# EAGLE design Lepadatu_Octavian-Stefan_Proiect2026 (EAGLE 9.7.0)
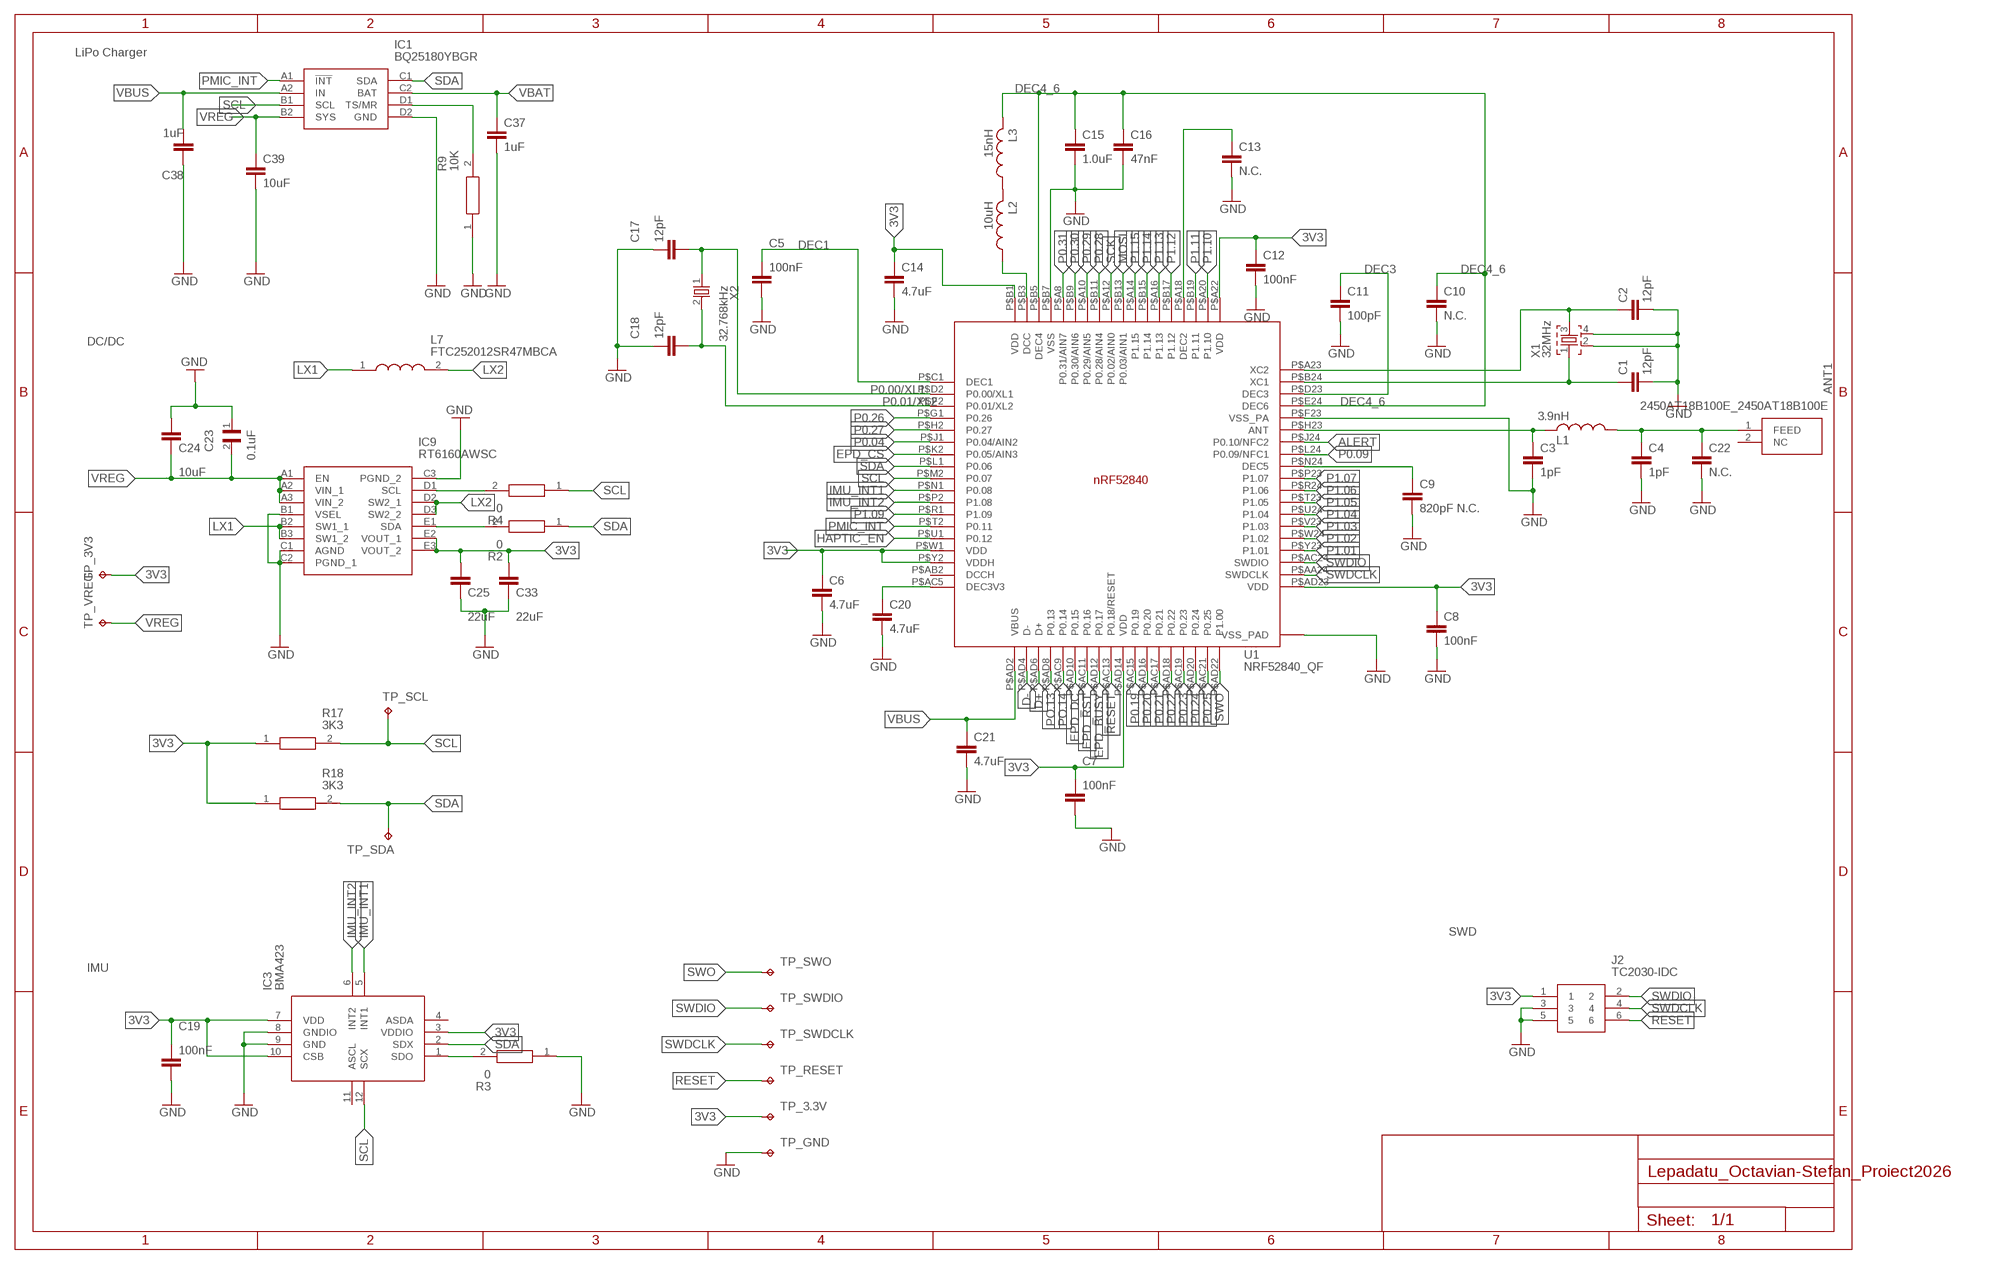
[diagram p0: schematic, sheet 1, part 1 of 2]
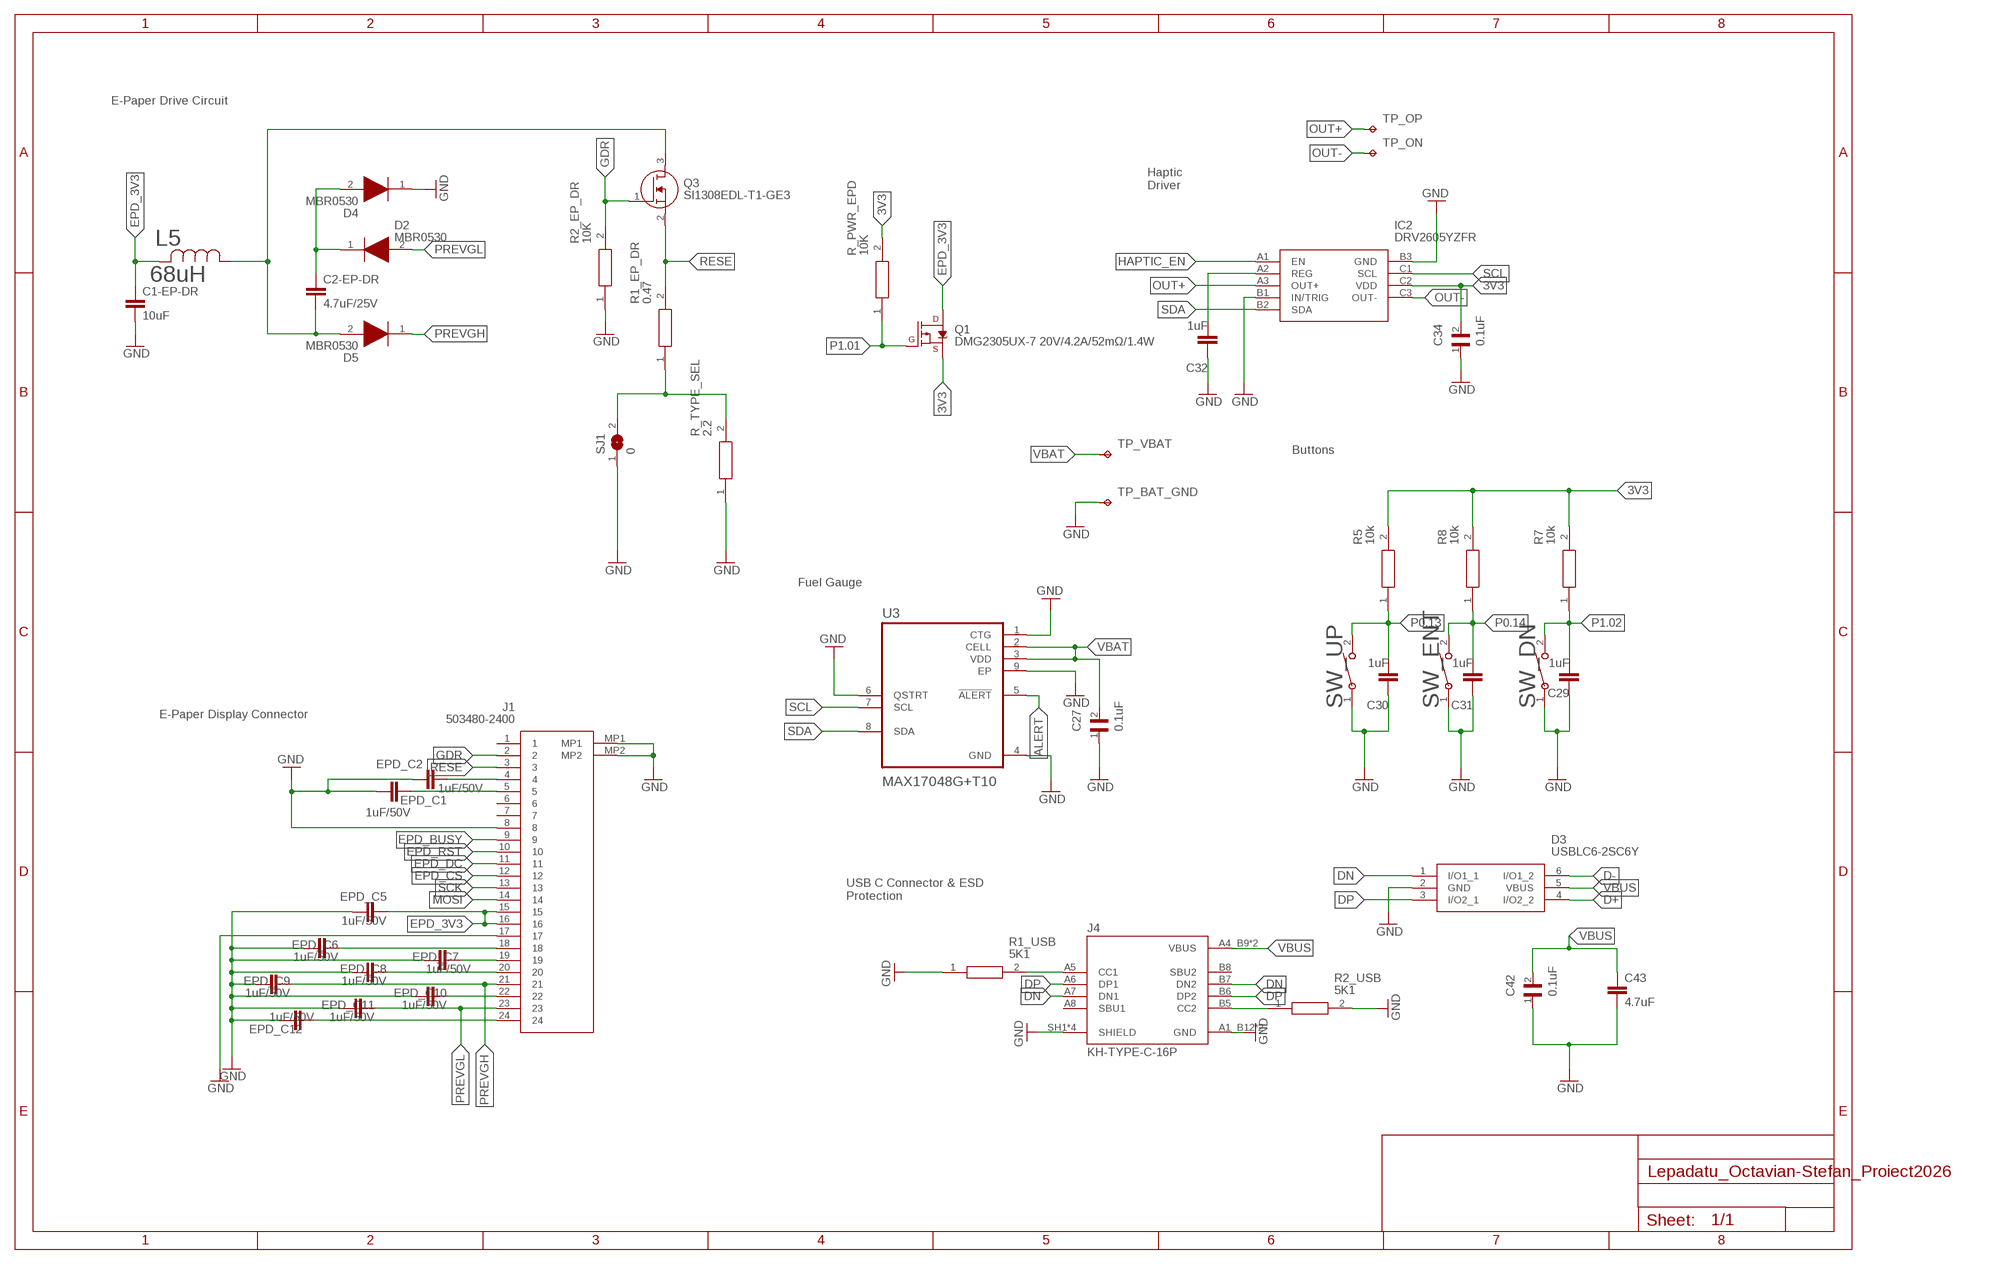
[diagram p1: schematic, sheet 1, part 2 of 2]

## Parts
ANT1  2450AT18B100E_2450AT18B100E  [2450AT18B100E_ANTC3216X140N]
C1  12pF  NORDIC_NRF_3_CAPACITOR_0201_L  [NORDIC_NRF_3_RESC0201_L]
C1-EP-DR  10uF  PERFECT_0402_CAP_0402  [PERFECT_0402_0402]
C2  12pF  NORDIC_NRF_3_CAPACITOR_0201_L  [NORDIC_NRF_3_RESC0201_L]
C2-EP-DR  4.7uF/25V  PERFECT_0402_CAP_0402  [PERFECT_0402_0402]
C3  1pF  NORDIC_NRF_3_CAPACITOR_0201_L  [NORDIC_NRF_3_RESC0201_L]
C4  1pF  NORDIC_NRF_3_CAPACITOR_0201_L  [NORDIC_NRF_3_RESC0201_L]
C5  100nF  NORDIC_NRF_3_CAPACITOR_0201_L  [NORDIC_NRF_3_RESC0201_L]
C6  4.7uF  PERFECT_0402_CAP_0402  [PERFECT_0402_0402]
C7  100nF  NORDIC_NRF_3_CAPACITOR_0201_L  [NORDIC_NRF_3_RESC0201_L]
C8  100nF  NORDIC_NRF_3_CAPACITOR_0201_L  [NORDIC_NRF_3_RESC0201_L]
C9  820pF N.C.  NORDIC_NRF_3_CAPACITOR_0201_L  [NORDIC_NRF_3_RESC0201_L]
C10  N.C.  NORDIC_NRF_3_CAPACITOR_0201_L  [NORDIC_NRF_3_RESC0201_L]
C11  100pF  NORDIC_NRF_3_CAPACITOR_0201_L  [NORDIC_NRF_3_RESC0201_L]
C12  100nF  NORDIC_NRF_3_CAPACITOR_0201_L  [NORDIC_NRF_3_RESC0201_L]
C13  N.C.  NORDIC_NRF_3_CAPACITOR_0201_L  [NORDIC_NRF_3_RESC0201_L]
C14  4.7uF  PERFECT_0402_CAP_0402  [PERFECT_0402_0402]
C15  1.0uF  PERFECT_0402_CAP_0402  [PERFECT_0402_0402]
C16  47nF  NORDIC_NRF_3_CAPACITOR_0201_L  [NORDIC_NRF_3_RESC0201_L]
C17  12pF  NORDIC_NRF_3_CAPACITOR_0201_L  [NORDIC_NRF_3_RESC0201_L]
C18  12pF  NORDIC_NRF_3_CAPACITOR_0201_L  [NORDIC_NRF_3_RESC0201_L]
C19  100nF  NORDIC_NRF_3_CAPACITOR_0201_L  [NORDIC_NRF_3_RESC0201_L]
C20  4.7uF  PERFECT_0402_CAP_0402  [PERFECT_0402_0402]
C21  4.7uF  PERFECT_0402_CAP_0402  [PERFECT_0402_0402]
C22  N.C.  NORDIC_NRF_3_CAPACITOR_0201_L  [NORDIC_NRF_3_RESC0201_L]
C23  0.1uF  GRM011R60J152KE01L_1_GRM011R60J152KE01L  [GRM011R60J152KE01L_1_0201]
C24  10uF  PERFECT_0402_CAP_0402  [PERFECT_0402_0402]
C25  22uF  PERFECT_0402_CAP_0402  [PERFECT_0402_0402]
C27  0.1uF  GRM011R60J152KE01L_2_GRM011R60J152KE01L  [GRM011R60J152KE01L_2_CAPC0201X13N]
C29  1uF  NORDIC_NRF_3_CAPACITOR_0402_L  [NORDIC_NRF_3_RESC0402_L]
C30  1uF  NORDIC_NRF_3_CAPACITOR_0402_L  [NORDIC_NRF_3_RESC0402_L]
C31  1uF  NORDIC_NRF_3_CAPACITOR_0402_L  [NORDIC_NRF_3_RESC0402_L]
C32  1uF  NORDIC_NRF_3_CAPACITOR_0402_L  [NORDIC_NRF_3_RESC0402_L]
C33  22uF  PERFECT_0402_CAP_0402  [PERFECT_0402_0402]
C34  0.1uF  GRM011R60J152KE01L_2_GRM011R60J152KE01L  [GRM011R60J152KE01L_2_CAPC0201X13N]
C37  1uF  NORDIC_NRF_3_CAPACITOR_0402_L  [NORDIC_NRF_3_RESC0402_L]
C38  1uF  NORDIC_NRF_3_CAPACITOR_0402_L  [NORDIC_NRF_3_RESC0402_L]
C39  10uF  NORDIC_NRF_3_CAPACITOR_0402_L  [NORDIC_NRF_3_RESC0402_L]
C42  0.1uF  GRM011R60J152KE01L_2_GRM011R60J152KE01L  [GRM011R60J152KE01L_2_CAPC0201X13N]
C43  4.7uF  PERFECT_0402_CAP_0402  [PERFECT_0402_0402]
D2  MBR0530  ESP32_C6_LIBRARY_5_MBR0530  [ESP32_C6_LIBRARY_5_SOD3716X135N]
D3  USBLC6-2SC6Y  ESP32_C6_LIBRARY_3_USBLC6-2SC6Y  [ESP32_C6_LIBRARY_3_SOT95P280X145-6N]
D4  MBR0530  ESP32_C6_LIBRARY_5_MBR0530  [ESP32_C6_LIBRARY_5_SOD3716X135N]
D5  MBR0530  ESP32_C6_LIBRARY_5_MBR0530  [ESP32_C6_LIBRARY_5_SOD3716X135N]
EPD_C1  1uF/50V  PERFECT_0402_CAP_0402  [PERFECT_0402_0402]
EPD_C2  1uF/50V  PERFECT_0402_CAP_0402  [PERFECT_0402_0402]
EPD_C5  1uF/50V  PERFECT_0402_CAP_0402  [PERFECT_0402_0402]
EPD_C6  1uF/50V  PERFECT_0402_CAP_0402  [PERFECT_0402_0402]
EPD_C7  1uF/50V  PERFECT_0402_CAP_0402  [PERFECT_0402_0402]
EPD_C8  1uF/50V  PERFECT_0402_CAP_0402  [PERFECT_0402_0402]
EPD_C9  1uF/50V  PERFECT_0402_CAP_0402  [PERFECT_0402_0402]
EPD_C10  1uF/50V  PERFECT_0402_CAP_0402  [PERFECT_0402_0402]
EPD_C11  1uF/50V  PERFECT_0402_CAP_0402  [PERFECT_0402_0402]
EPD_C12  1uF/50V  PERFECT_0402_CAP_0402  [PERFECT_0402_0402]
IC1  BQ25180YBGR  BQ25180YBGR_BQ25180YBGR  [BQ25180YBGR_BGA8C40P2X4_100X155X50]
IC2  DRV2605YZFR  DRV2605YZFR_DRV2605YZFR  [DRV2605YZFR_BGA9C50P3X3_144X144X62]
IC3  BMA423  BMA423_BMA423  [BMA423_BMA423]
IC9  RT6160AWSC  RT6160AWSC_RT6160AWSC  [RT6160AWSC_BGA15C40P3X5_140X230X60]
J1  503480-2400  503480-2400_503480-2400  [503480-2400_5034802400]
J2  TC2030-IDC  TC2030-IDC_TC2030-IDC  [TC2030-IDC_TC2030IDC]
J4  KH-TYPE-C-16P  KH-TYPE-C-16P_KH-TYPE-C-16P  [KH-TYPE-C-16P_KINGHELM_KH-TYPE-C-16P]
L1  3.9nH  NORDIC_NRF_2_INDUCTOR_0402_L  [NORDIC_NRF_2_RESC0402_L]
L2  10uH  NORDIC_NRF_2_INDUCTOR_0402_L  [NORDIC_NRF_2_RESC0402_L]
L3  15nH  NORDIC_NRF_2_INDUCTOR_0402_L  [NORDIC_NRF_2_RESC0402_L]
L5  68uH  ESP32_C6_LIBRARY_2_744043680IND_4828-WE-TPC_WRE  [ESP32_C6_LIBRARY_2_IND_4828-WE-TPC_WRE]
L7  FTC252012SR47MBCA  MLP2016SR47MT0S1_FTC252012SR47MBCA  [MLP2016SR47MT0S1_INDC2016X100N]
Q1  DMG2305UX-7 20V/4.2A/52mΩ/1.4W  ESP32_C6_LIBRARY_4_ESP32_WROVER_SPARKFUN-DISCRETESEMI_MOSFET_PCH-DMG2305UX-7  [ESP32_C6_LIBRARY_4_ESP32_C6_LIBRARY_4_ESP32_C6_LIBRARY_4_ESP32_C6_LIBRARY_4_ESP32_WROVER_SPARKFUN-DISCRETESEMI_SOT23-3]
Q3  SI1308EDL-T1-GE3  ESP32_C6_LIBRARY_6_SI1308EDL-T1-GE3  [ESP32_C6_LIBRARY_6_SOT65P210X110-3N]
R1_EP_DR  0.47  ERA-1AEB3401C_CPF0201D7K68C1  [ERA-1AEB3401C_0201]
R1_USB  5K1  CPF0201D7K68C1_CPF0201D7K68C1  [CPF0201D7K68C1_0201]
R2  0  ERA-1AEB3401C_CPF0201D7K68C1  [ERA-1AEB3401C_0201]
R2_EP_DR  10K  ERA-1AEB3401C_CPF0201D7K68C1  [ERA-1AEB3401C_0201]
R2_USB  5K1  CPF0201D7K68C1_CPF0201D7K68C1  [CPF0201D7K68C1_0201]
R3  0  CPF0201D7K68C1_CPF0201D7K68C1  [CPF0201D7K68C1_0201]
R4  0  ERA-1AEB3401C_CPF0201D7K68C1  [ERA-1AEB3401C_0201]
R5  10k  CPF0201D7K68C1_CPF0201D7K68C1  [CPF0201D7K68C1_0201]
R7  10k  CPF0201D7K68C1_CPF0201D7K68C1  [CPF0201D7K68C1_0201]
R8  10k  CPF0201D7K68C1_CPF0201D7K68C1  [CPF0201D7K68C1_0201]
R9  10K  ERA-1AEB3401C_CPF0201D7K68C1  [ERA-1AEB3401C_0201]
R17  3K3  ERA-1AEB3401C_CPF0201D7K68C1  [ERA-1AEB3401C_0201]
R18  3K3  ERA-1AEB3401C_CPF0201D7K68C1  [ERA-1AEB3401C_0201]
R_PWR_EPD  10K  CPF0201D7K68C1_CPF0201D7K68C1  [CPF0201D7K68C1_0201]
R_TYPE_SEL  2.2  ERA-1AEB3401C_CPF0201D7K68C1  [ERA-1AEB3401C_0201]
SJ1  0  ESP32_C6_LIBRARY_7_JUMPER_SJ  [ESP32_C6_LIBRARY_7_JUMPER_SJ]
SW_DN  2025-10-22_07-23-44_LIBRARY_EVP-AKE31ASW_EVP-AKE31A_PAN  [2025-10-22_07-23-44_LIBRARY_SW_EVP-AKE31A_PAN]
SW_ENT  2025-10-22_07-23-44_LIBRARY_EVP-AKE31ASW_EVP-AKE31A_PAN  [2025-10-22_07-23-44_LIBRARY_SW_EVP-AKE31A_PAN]
SW_UP  2025-10-22_07-23-44_LIBRARY_EVP-AKE31ASW_EVP-AKE31A_PAN  [2025-10-22_07-23-44_LIBRARY_SW_EVP-AKE31A_PAN]
TP_3.3V  HECTOR_WATCH_1_TPTP20R  [HECTOR_WATCH_1_TP20R]
TP_3V3  HECTOR_WATCH_1_TPTP20R  [HECTOR_WATCH_1_TP20R]
TP_BAT_GND  HECTOR_WATCH_1_TPTP20R  [HECTOR_WATCH_1_TP20R]
TP_GND  HECTOR_WATCH_1_TPTP20R  [HECTOR_WATCH_1_TP20R]
TP_ON  HECTOR_WATCH_1_TPTP20R  [HECTOR_WATCH_1_TP20R]
TP_OP  HECTOR_WATCH_1_TPTP20R  [HECTOR_WATCH_1_TP20R]
TP_RESET  HECTOR_WATCH_1_TPTP20R  [HECTOR_WATCH_1_TP20R]
TP_SCL  HECTOR_WATCH_1_TPTP20R  [HECTOR_WATCH_1_TP20R]
TP_SDA  HECTOR_WATCH_1_TPTP20R  [HECTOR_WATCH_1_TP20R]
TP_SWDCLK  HECTOR_WATCH_1_TPTP20R  [HECTOR_WATCH_1_TP20R]
TP_SWDIO  HECTOR_WATCH_1_TPTP20R  [HECTOR_WATCH_1_TP20R]
TP_SWO  HECTOR_WATCH_1_TPTP20R  [HECTOR_WATCH_1_TP20R]
TP_VBAT  HECTOR_WATCH_1_TPTP20R  [HECTOR_WATCH_1_TP20R]
TP_VREG  HECTOR_WATCH_1_TPTP20R  [HECTOR_WATCH_1_TP20R]
U1  NRF52840_QF  NORDIC_NRF_4_NRF52840_QF  [NORDIC_NRF_4_AQFN50P700X700X85_HS-74N]
U3  MAX17048G+T10  ESP32_C6_LIBRARY_MAX17048G+T10  [ESP32_C6_LIBRARY_SON50P200X200X80-9N]
X1  32MHz  NORDIC_NRF_XTAL_32MHZ  [NORDIC_NRF_BT-XTAL_2016_N]
X2  32.768kHz  NORDIC_NRF_1_XTAL_32KHZ  [NORDIC_NRF_1_XTAL_3215_N]

## Nets
3V3 [Power]: C6.1 C7.1 C8.1 C12.1 C14.1 C19.1 C25.1 C33.1 C34.2 IC2.C2(VDD) IC3.3(VDDIO) IC3.7(VDD) IC3.10(CSB) IC9.E2(VOUT_1) IC9.E3(VOUT_2) J2.1 Q1.2(S) R5.2 R7.2 R8.2 R17.1 R18.1 R_PWR_EPD.2 TP_3.3V.TP TP_3V3.TP U1.P$A22(VDD) U1.P$AD14(VDD) U1.P$AD23(VDD) U1.P$B1(VDD) U1.P$W1(VDD) U1.P$Y2(VDDH)
ALERT: U1.P$J24(P0.10/NFC2) U3.5(!ALERT)
D+: D3.4(I/O2_2) U1.P$AD6(D+)
D-: D3.6(I/O1_2) U1.P$AD4(D-)
DEC1: C5.1 U1.P$C1(DEC1)
DEC3: C11.1 U1.P$D23(DEC3)
DEC4_6: C10.1 C15.1 C16.1 L3.2 U1.P$B5(DEC4) U1.P$E24(DEC6)
DN: D3.1(I/O1_1) J4.A7(DN1) J4.B7(DN2)
DP: D3.3(I/O2_1) J4.A6(DP1) J4.B6(DP2)
EPD_3V3 [Power]: C1-EP-DR.1 EPD_C5.2 J1.15 J1.16 L5.2 Q1.3(D)
EPD_BUSY: J1.9 U1.P$AD12(P0.17)
EPD_CS: J1.12 U1.P$K2(P0.05/AIN3)
EPD_DC: J1.11 U1.P$AD10(P0.15)
EPD_RST: J1.10 U1.P$AC11(P0.16)
GDR: J1.2 Q3.1(G) R2_EP_DR.2
GND: C1-EP-DR.2 C1.2 C2.2 C3.2 C4.2 C5.2 C6.2 C7.2 C8.2 C9.2 C10.2 C11.2 C12.2 C13.2 C14.2 C15.2 C16.2 C17.1 C18.1 C19.2 C20.2 C21.2 C22.2 C23.1 C24.1 C25.2 C27.1 C29.1 C30.1 C31.1 C32.1 C33.2 C34.1 C37.2 C38.1 C39.2 C42.1 C43.2 D3.2(GND) D4.1(K) EPD_C1.1 EPD_C2.1 EPD_C5.1 EPD_C6.1 EPD_C7.1 EPD_C8.1 EPD_C9.1 EPD_C10.1 EPD_C11.1 EPD_C12.1 IC1.D2(GND) IC2.B1(IN/TRIG) IC2.B3(GND) IC3.8(GNDIO) IC3.9(GND) IC9.B1(VSEL) IC9.C1(AGND) IC9.C2(PGND_1) IC9.C3(PGND_2) J1.8 J1.17 J1.MP1 J1.MP2 J2.3 J2.5 J4.A1_B12(GND) J4.A12_B1(GND) J4.SH1(SHIELD) J4.SH2(SHIELD) J4.SH3(SHIELD) J4.SH4(SHIELD) R1_USB.1 R2_EP_DR.1 R2_USB.2 R3.1 R9.1 R_TYPE_SEL.1 SJ1.1 SW_DN.1 SW_ENT.1 SW_UP.1 TP_BAT_GND.TP TP_GND.TP U1.P$74(VSS_PAD) U1.P$75(VSS_PAD) U1.P$76(VSS_PAD) U1.P$77(VSS_PAD) U1.P$78(VSS_PAD) U1.P$79(VSS_PAD) U1.P$80(VSS_PAD) U1.P$81(VSS_PAD) U1.P$82(VSS_PAD) U1.P$83(VSS_PAD) U1.P$84(VSS_PAD) U1.P$85(VSS_PAD) U1.P$86(VSS_PAD) U1.P$87(VSS_PAD) U1.P$88(VSS_PAD) U1.P$89(VSS_PAD) U1.P$90(VSS_PAD) U1.P$B7(VSS) U1.P$F23(VSS_PA) U3.1(CTG) U3.4(GND) U3.6(QSTRT) U3.9(EP) X1.2 X1.4
HAPTIC_EN: IC2.A1(EN) U1.P$U1(P0.12)
IMU_INT1: IC3.5(INT1) U1.P$N1(P0.08)
IMU_INT2: IC3.6(INT2) U1.P$P2(P1.08)
LX1: IC9.B2(SW1_1) IC9.B3(SW1_2) L7.1
LX2: IC9.D2(SW2_1) IC9.D3(SW2_2) L7.2
MOSI: J1.14 U1.P$B13(P0.03/AIN1)
N$1: ANT1.1(FEED) C4.1 C22.1 L1.2
N$2: IC9.D1(SCL) R4.2
N$3: IC1.D1(TS/MR) R9.2
N$4: C2.1 U1.P$A23(XC2) X1.3
N$5: IC9.E1(SDA) R2.2
N$6: J4.A5(CC1) R1_USB.2
N$7: L2.2 L3.1
N$8: IC3.1(SDO) R3.2
N$9: C1.1 U1.P$B24(XC1) X1.1
N$10: C3.1 L1.1 U1.P$H23(ANT)
N$11: C32.2 IC2.A2(REG)
N$13: C2-EP-DR.1 D2.1(K) D4.2(A)
N$14: C9.1 U1.P$N24(DEC5)
N$15: R1_EP_DR.1 R_TYPE_SEL.2 SJ1.2
N$16: C2-EP-DR.2 D5.2(A) L5.1 Q3.3(D)
N$17: EPD_C2.2 J1.4
N$18: EPD_C1.2 J1.5
N$20: C20.1 U1.P$AC5(DEC3V3)
N$22: L2.1 U1.P$B3(DCC)
N$26: J4.B5(CC2) R2_USB.1
N$30: EPD_C6.2 J1.18
N$31: EPD_C7.2 J1.19
N$32: EPD_C8.2 J1.20
N$34: EPD_C10.2 J1.22
N$35: C13.1 U1.P$A18(DEC2)
N$37: EPD_C12.2 J1.24
OUT+: IC2.A3(OUT+) TP_OP.TP
OUT-: IC2.C3(OUT-) TP_ON.TP
P0.00/XL1: C17.2 U1.P$D2(P0.00/XL1) X2.1
P0.01/XL2: C18.2 U1.P$F2(P0.01/XL2) X2.2
P0.04: U1.P$J1(P0.04/AIN2)
P0.09: U1.P$L24(P0.09/NFC1)
P0.13: C30.2 R5.1 SW_UP.2
P0.14: C31.2 R8.1 SW_ENT.2
P0.19: U1.P$AC15(P0.19)
P0.20: U1.P$AD16(P0.20)
P0.21: U1.P$AC17(P0.21)
P0.22: U1.P$AD18(P0.22)
P0.23: U1.P$AC19(P0.23)
P0.24: U1.P$AD20(P0.24)
P0.25: U1.P$AC21(P0.25)
P0.26: U1.P$G1(P0.26)
P0.27: U1.P$H2(P0.27)
P0.28: U1.P$B11(P0.28/AIN4)
P0.29: U1.P$A10(P0.29/AIN5)
P0.30: U1.P$B9(P0.30/AIN6)
P0.31: U1.P$A8(P0.31/AIN7)
P1.01: Q1.1(G) R_PWR_EPD.1 U1.P$Y23(P1.01)
P1.02: C29.2 R7.1 SW_DN.2 U1.P$W24(P1.02)
P1.03: U1.P$V23(P1.03)
P1.04: U1.P$U24(P1.04)
P1.05: U1.P$T23(P1.05)
P1.06: U1.P$R24(P1.06)
P1.07: U1.P$P23(P1.07)
P1.09: U1.P$R1(P1.09)
P1.10: U1.P$A20(P1.10)
P1.11: U1.P$B19(P1.11)
P1.12: U1.P$B17(P1.12)
P1.13: U1.P$A16(P1.13)
P1.14: U1.P$B15(P1.14)
P1.15: U1.P$A14(P1.15)
PMIC_INT: IC1.A1(!INT) U1.P$T2(P0.11)
PO.13: U1.P$AD8(P0.13)
PO.14: U1.P$AC9(P0.14)
PREVGH: D5.1(K) EPD_C9.2 J1.21
PREVGL: D2.2(A) EPD_C11.2 J1.23
RESE: J1.3 Q3.2(S) R1_EP_DR.2
RESET: J2.6 TP_RESET.TP U1.P$AC13(P0.18/RESET)
SCK: J1.13 U1.P$A12(P0.02/AIN0)
SCL: IC1.B1(SCL) IC2.C1(SCL) IC3.12(SCX) R4.1 R17.2 TP_SCL.TP U1.P$M2(P0.07) U3.7(SCL)
SDA: IC1.C1(SDA) IC2.B2(SDA) IC3.2(SDX) R2.1 R18.2 TP_SDA.TP U1.P$L1(P0.06) U3.8(SDA)
SWDCLK: J2.4 TP_SWDCLK.TP U1.P$AA24(SWDCLK)
SWDIO: J2.2 TP_SWDIO.TP U1.P$AC24(SWDIO)
SWO: TP_SWO.TP U1.P$AD22(P1.00)
VBAT [Power]: C27.2 C37.1 IC1.C2(BAT) TP_VBAT.TP U3.2(CELL) U3.3(VDD)
VBUS [Power]: C21.1 C38.2 C42.2 C43.1 D3.5(VBUS) IC1.A2(IN) J4.A4_B9(VBUS) J4.A9_B4(VBUS) U1.P$AD2(VBUS)
VREG [Power]: C23.2 C24.2 C39.1 IC1.B2(SYS) IC9.A1(EN) IC9.A2(VIN_1) IC9.A3(VIN_2) TP_VREG.TP
Unconnected: ANT1.2(NC) IC3.4(ASDA) IC3.11(ASCL) J1.1 J1.6 J1.7 J4.A8(SBU1) J4.B8(SBU2) U1.P$AB2(DCCH)

## Notes on the sheet
- LiPo Charger
- DC/DC
- SWD
- IMU
- E-Paper Drive Circuit
- Haptic
  Driver
- Buttons
- Fuel Gauge
- E-Paper Display Connector
- USB C Connector & ESD
  Protection

## Library data of the parts
ANT1 = InkTime_v5:2450AT18B100E_2450AT18B100E: Antennas 2.45GHz ANTENNA Source: Datasheet <https://www.johansontechnology.com/datasheets/2450AT18B100/2450AT18B100.pdf>
C1-C5 C7-C13 C16-C19 C22 C29-C32 C37-C39 = InkTime_v5:NORDIC_NRF_3_CAPACITOR: Generic chip capacitor
C1-EP-DR C2-EP-DR C6 C14 C15 C20 C21 C24 C25 C33 C43 EPD_C1 EPD_C2 EPD_C5-EPD_C12 = InkTime_v5:PERFECT_0402_CAP_0402: 0402 (1005 Metric) Nick Garner - TeleSense
C23 = InkTime_v5:GRM011R60J152KE01L_1_GRM011R60J152KE01L: Check availability <https://pricing.snapeda.com/parts/GRM011R60J152KE01L/Murata/view-part?ref=eda>
C27 C34 C42 = InkTime_v5:GRM011R60J152KE01L_2_GRM011R60J152KE01L: Check availability <https://pricing.snapeda.com/parts/GRM011R60J152KE01L/Murata/view-part?ref=eda>
D2 D4 D5 = InkTime_v5:ESP32_C6_LIBRARY_5_MBR0530: ON SEMICONDUCTOR - MBR0530 - DIODE, SCHOTTKY, 0.5A, 30V, SOD-123 Source: Datasheet <http://www.onsemi.com/pub/Collateral/MBR0530T1-D.PDF> Check availability <https://pricing.snapeda.com/parts/MBR0530/ON%20Semiconductor/view-part?ref=eda>
D3 = InkTime_v5:ESP32_C6_LIBRARY_3_USBLC6-2SC6Y: Low Cap. ESD Protection Auto SOT-23-6 STMicroelectronics USBLC6-2SC6Y, Dual Uni-Directional TVS Diode Array, 6-Pin SOT-23 Source: Datasheet <https://componentsearchengine.com/Datasheets/1/USBLC6-2SC6Y.pdf> Check availability <https://pricing.snapeda.com/parts/USBLC6-2SC6Y/STMicroelectronics/view-part?ref=eda>
IC1 = InkTime_v5:BQ25180YBGR_BQ25180YBGR: Charger IC Lithium Ion/Polymer, Lithium Iron Phosphate 8-DSBGA (1.6x1.1) Source: Datasheet <https://www.ti.com/lit/ds/symlink/bq25180.pdf?ts=1650264094470&ref_url=https%3A%2F%2Fwww.ti.com%2Fproduct%2FBQ25180>
IC2 = InkTime_v5:DRV2605YZFR_DRV2605YZFR: Haptic Driver for ERM/LRA with Built-In Library and Smart Loop Architecture Source: Datasheet <http://www.ti.com/lit/gpn/drv2605>
IC3 = InkTime_v5:BMA423_BMA423: Accelerometers Triaxial low-g 12bit Acceleration Sensor Source: Datasheet <https://www.mouser.com/datasheet/2/783/BST-BMA423-DS000-1509600.pdf>
IC9 = InkTime_v5:RT6160AWSC_RT6160AWSC: Buck-Boost Regulator Positive Output Step-Up/Step-Down I2C DC-DC Controller IC 15-WL-CSP (BSC) (1.4x2.3) Source: Datasheet <https://www.richtek.com/SaveDownload.aspx?specid=RT6160A>
J1 = InkTime_v5:503480-2400_503480-2400: FFC & FPC Connectors 0.5mm FPC RA SMT Dual Contact 24Ckt Source: Datasheet <https://componentsearchengine.com/Datasheets/1/503480-2400.pdf>
J2 = InkTime_v5:TC2030-IDC_TC2030-IDC: CABLE ADAPTER 6 POS Source: Datasheet <https://datasheet.datasheetarchive.com/originals/distributors/Datasheets_SAMA/62bc384e093448baaaa63dbd0b9d8707.pdf>
J4 = InkTime_v5:KH-TYPE-C-16P_KH-TYPE-C-16P: Check availability <https://pricing.snapeda.com/parts/KH-TYPE-C-16P/kinghelm/view-part?ref=eda>
L1-L3 = InkTime_v5:NORDIC_NRF_2_INDUCTOR: Generic chip inductor
L5 = InkTime_v5:ESP32_C6_LIBRARY_2_744043680
L7 = InkTime_v5:MLP2016SR47MT0S1_FTC252012SR47MBCA: SMD / SMT Inductors (Coils), L=0.47?H, L x W x T : Source: Datasheet <https://product.tdk.com/system/files/dam/doc/product/inductor/inductor/smd/catalog/inductor_commercial_power_mlp2016_en.pdf>
Q1 = InkTime_v5:ESP32_C6_LIBRARY_4_ESP32_WROVER_SPARKFUN-DISCRETESEMI_MOSFET_PCH: P-channel MOSFETs Voltage controlled devices that allow control of high current outputs. SparkFun Products: SparkFun ESP32 Thing <https://www.sparkfun.com/products/13907> SparkFun ESP8266 Thing <https://www.sparkfun.com/products/13231> SparkFun Pi Servo HAT V2 <https://www.sparkfun.com/products/15316> DMG2305UX-7 (20V/4.2A/SOT23-3)
Q3 = InkTime_v5:ESP32_C6_LIBRARY_6_SI1308EDL-T1-GE3: MOSFET N-Ch 30V 1.5A TrenchFET SC70 Vishay Si1308EDL-T1-GE3 N-channel MOSFET Transistor, 1.5 A, 30 V, 3-Pin SC-70 Source: Datasheet <https://componentsearchengine.com/Datasheets/1/SI1308EDL-T1-GE3.pdf> Check availability <https://pricing.snapeda.com/parts/SI1308EDL-T1-GE3/Vishay%20Siliconix/view-part?ref=eda>
R1_EP_DR R2 R2_EP_DR R4 R9 R17 R18 R_TYPE_SEL = InkTime_v5:ERA-1AEB3401C_CPF0201D7K68C1: 7.68k 0201 Thin Film Surface Mount Fixed Resistor +/-0.5% 0.031W CPF0201D7K68C1 Source: Datasheet <http://www.te.com/commerce/DocumentDelivery/DDEController?Action=showdoc&DocId=Data Sheet1773200-1ApdfEnglishENG_DS_1773200-1_A.pdf4-2176215-6>
R1_USB R2_USB R3 R5 R7 R8 R_PWR_EPD = InkTime_v5:CPF0201D7K68C1_CPF0201D7K68C1: 7.68k 0201 Thin Film Surface Mount Fixed Resistor +/-0.5% 0.031W CPF0201D7K68C1 Source: Datasheet <http://www.te.com/commerce/DocumentDelivery/DDEController?Action=showdoc&DocId=Data Sheet1773200-1ApdfEnglishENG_DS_1773200-1_A.pdf4-2176215-6>
SJ1 = InkTime_v5:ESP32_C6_LIBRARY_7_JUMPER_SJ: SMD solder JUMPER
SW_DN SW_ENT SW_UP = InkTime_v5:2025-10-22_07-23-44_LIBRARY_EVP-AKE31A
TP_3.3V TP_3V3 TP_BAT_GND TP_GND TP_ON TP_OP TP_RESET TP_SCL TP_SDA TP_SWDCLK TP_SWDIO TP_SWO TP_VBAT TP_VREG = InkTime_v5:HECTOR_WATCH_1_TP: Test pad
U1 = InkTime_v5:NORDIC_NRF_4_NRF52840_QF: nRF52840 Features Advanced Single chip 2.4 GHz multi-protocol SoC 32-bit ARM Cortex-M4F Processor 1.7v to 5.5v operation 1MB flash + 256kB RAM Bluetooth 5 support for long range and high throughput 802.15.4 radio support On-chip NFC PPI –Programmable Peripheral Interconnect Automated power management system with automatic power management of each peripheral Configurable I/O mapping for analog and digital I/O 48 x GPIO 1 x QSPI 4 x Master/Slave SPI 2 x Two-wire interface (I²C) I²S interface 2 x UART 4 x PWM USB 2.0 controller ARM TrustZone CryptoCell-310 Cryptographic and security module AES 128-bit ECB/CCM/AAR hardware accelerator Digital microphone interface (PDM) Quadrature decoder 12-bit ADC Low power comparator On-chip 50Ω balun On-air compatible with nRF52, nRF51 and nRF24 Series Applications Advanced high performance wearables Wearables for secure payments Virtual Reality/Augmented Reality systems Smart Home sensor networks Smart city sensor networks High performance HID controllers Internet of Things (IoT) sensor networks Smart door locks Smart lighting networks Connected white goods
U3 = InkTime_v5:ESP32_C6_LIBRARY_MAX17048G+T10: Check availability <https://pricing.snapeda.com/parts/MAX17048G%2BT10/Analog%20Devices/view-part?ref=eda>
X1 = InkTime_v5:NORDIC_NRF_XTAL_32MHZ
X2 = InkTime_v5:NORDIC_NRF_1_XTAL_32KHZ

## Board
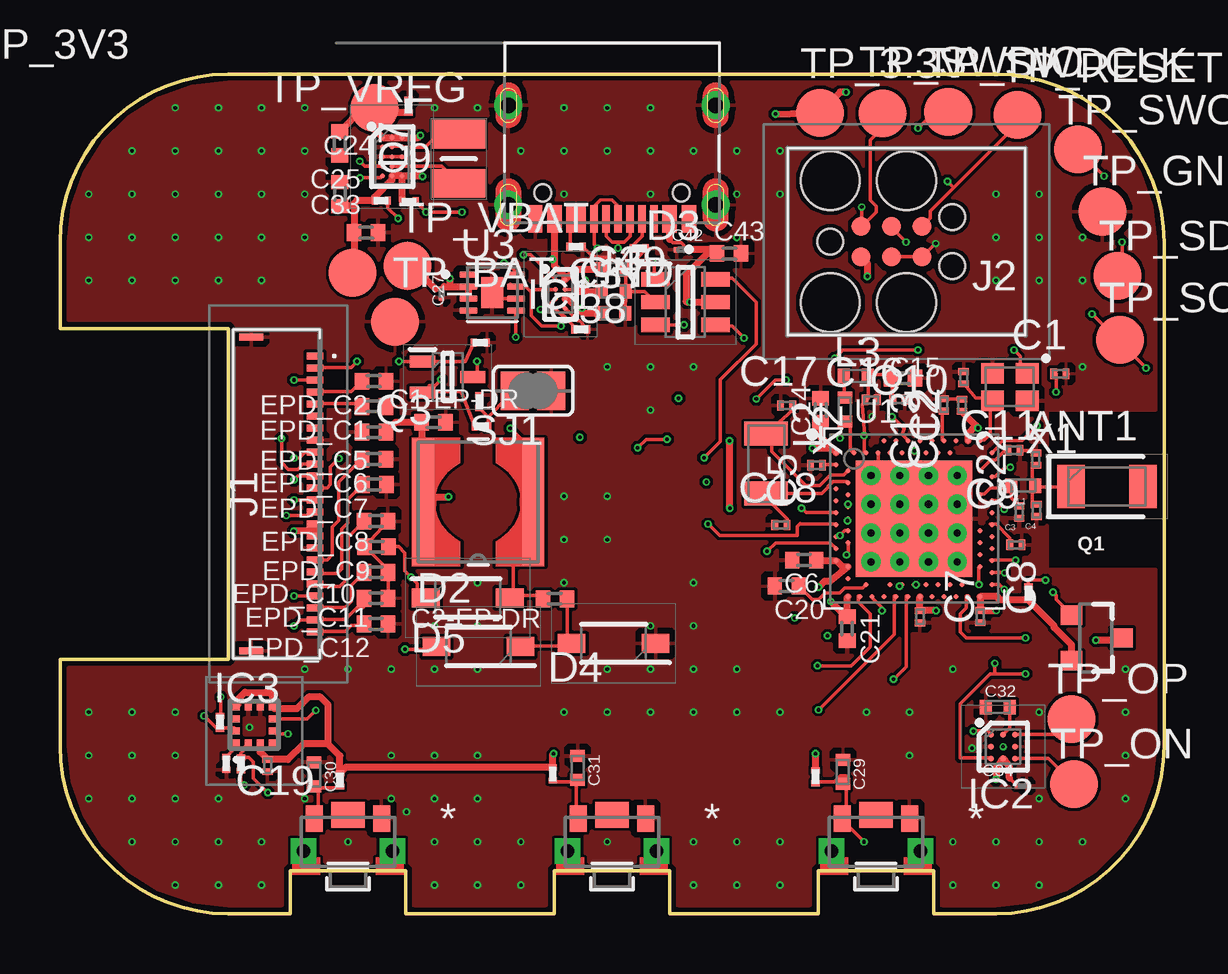
[diagram p2: board, top side]
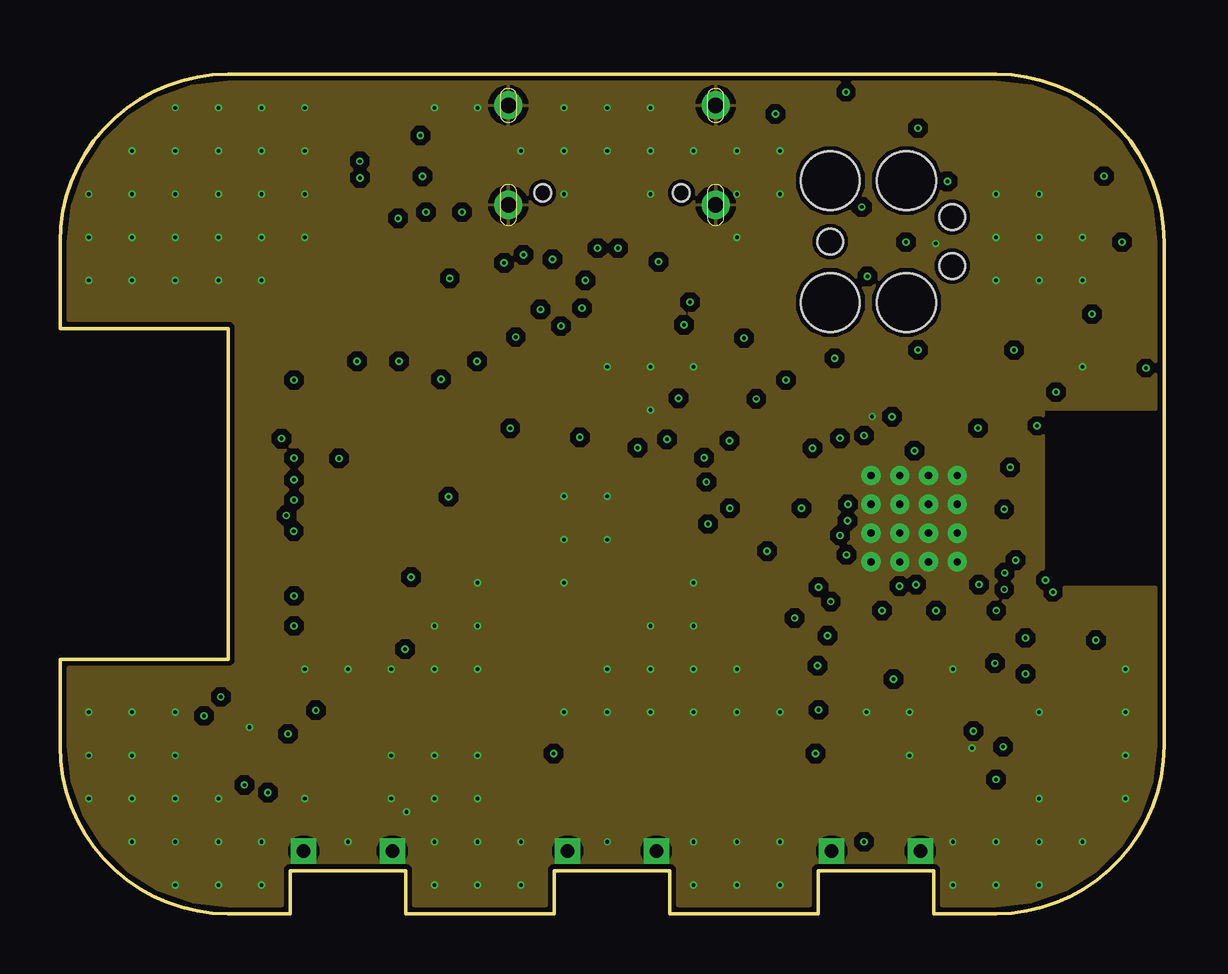
[diagram p3: board, inner layer Route2]
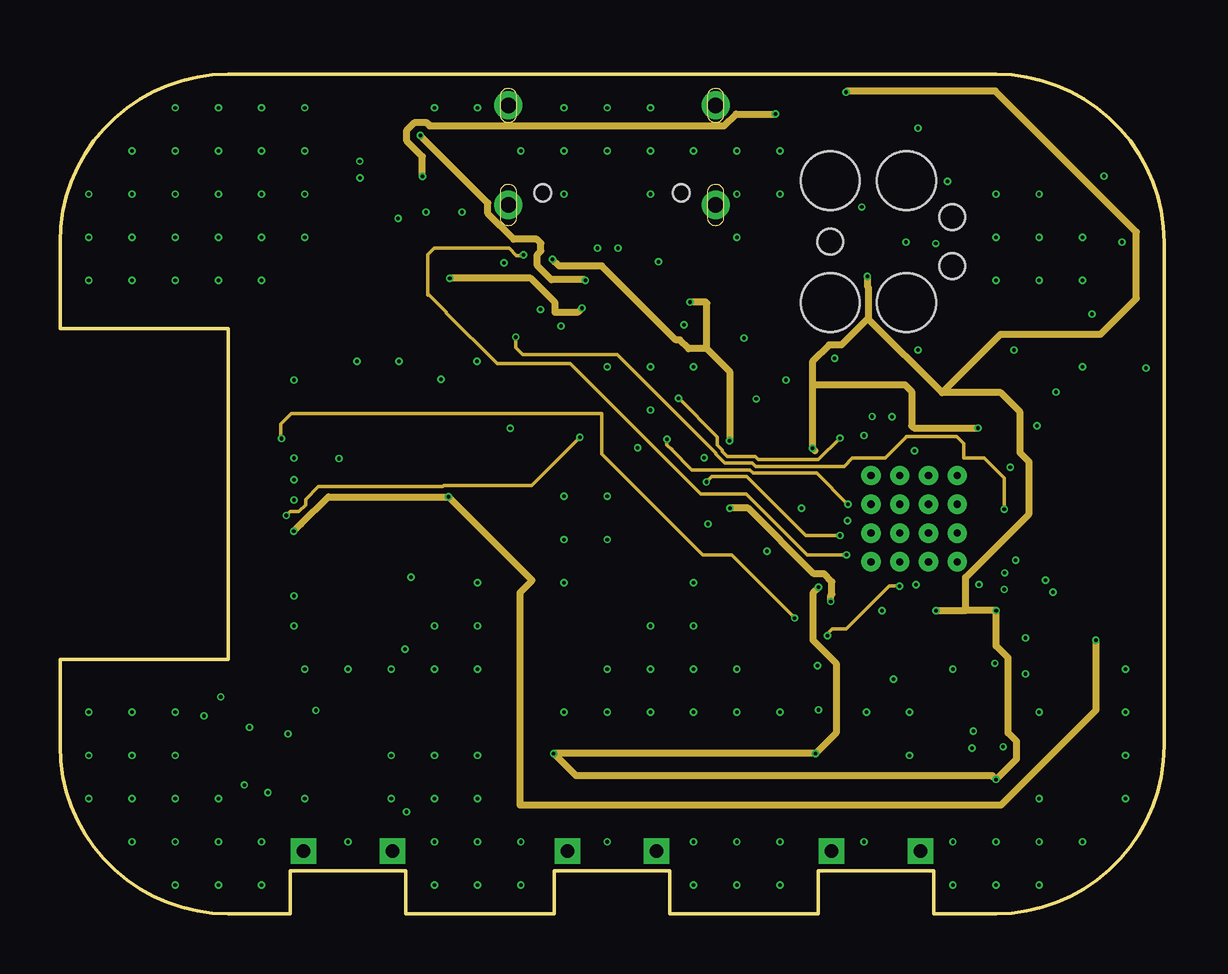
[diagram p4: board, inner layer Route63]
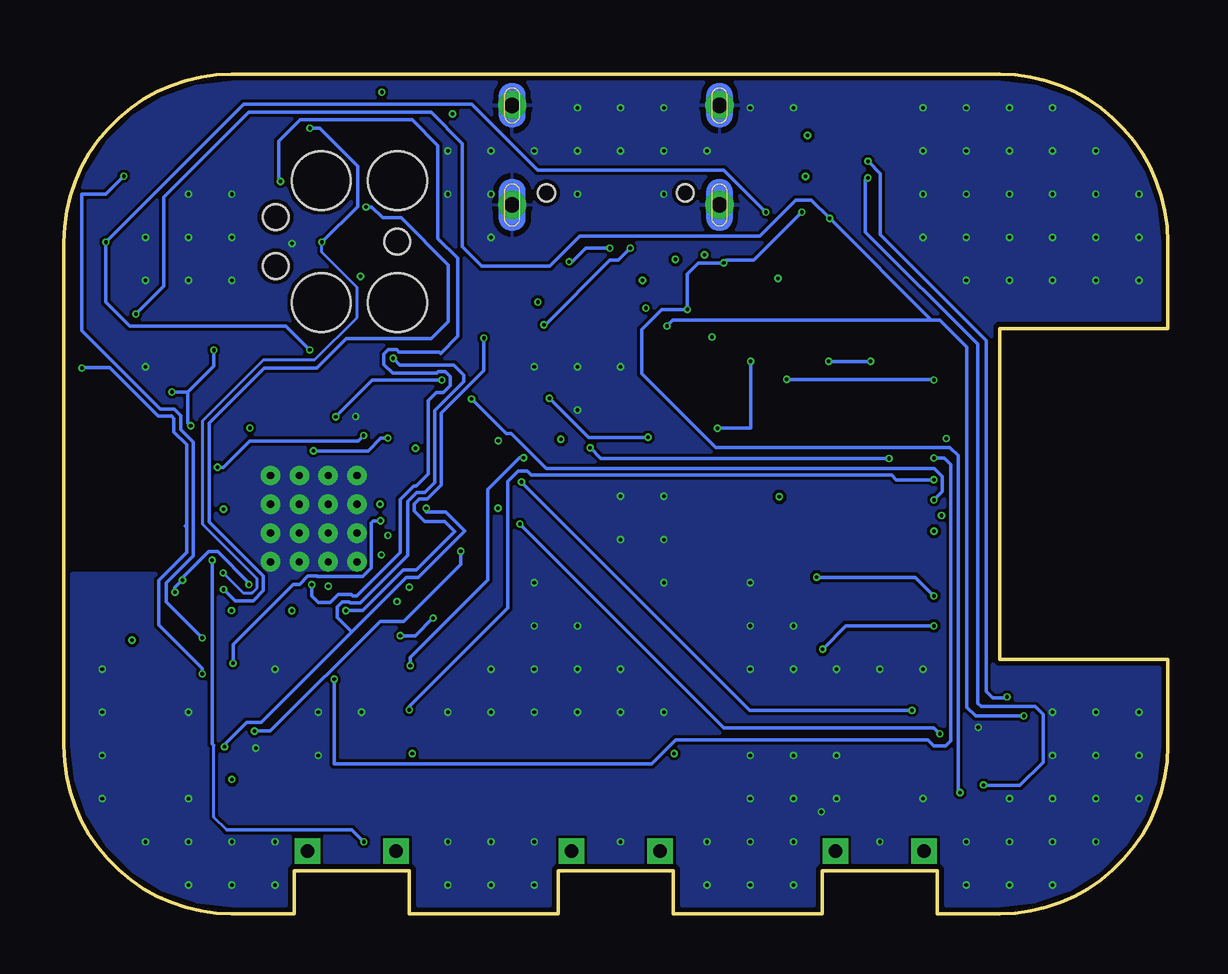
[diagram p5: board, bottom side, seen from below]

Size 46 x 35 mm. Coordinates in mm from the lower left corner, seen from the top.
Outline: 39,0 36.4,0 36.4,1.8 31.6,1.8 31.6,0 25.4,0 25.4,1.8 20.6,1.8 20.6,0 14.4,0 14.4,1.8 9.6,1.8 9.6,0 7,0 arc-90 0,7 0,10.6 7,10.6 7,24.4 0,24.4 0,28 arc-90 7,35 39,35 arc-90 46,28 46,7 arc-90 39,0
Copper layers (1+2*15+16): Top / Route2 / Route63 / Bottom
Stack-up 4 Layer Stack: Top SilkScreen Epoxy Ink / Top SolderMask SR:Green 0.0254mm Dk 4.3 / Top Surface Finish Lead-Free 0.02mm / Top CuFoil:007 0.035mm / Dielectric-1 Prepreg:003 0.061mm / Dielectric-2 Prepreg:003 0.061mm / Route2 CuFoil:007 0.035mm / Dielectric-3 Core:070 0.533mm / Route63 CuFoil:007 0.035mm / Dielectric-4 Prepreg:003 0.061mm / Dielectric-5 Prepreg:003 0.061mm / Bottom CuFoil:007 0.035mm / Bottom Surface Finish Lead-Free 0.02mm / Bottom SolderMask SR:Green 0.0254mm Dk 4.3 / Bottom SilkScreen Epoxy Ink
Design rules: minimum copper width 5mil, minimum drill size 0.15mm, copper clearance wire_polygon to wire_polygon 5mil, copper clearance wire_polygon to pad_smd 5mil, copper clearance wire_polygon to via 5mil, copper clearance pad_smd to pad_smd 5mil, copper clearance pad_smd to via 5mil, copper clearance via to via 5mil, copper clearance smd to pad (same net) 5mil, copper clearance smd to via (same net) 5mil, copper clearance smd to smd (same net) 5mil, dimension clearance 0.2mm, via restrict clearance 0mil, restrict clearance 0mil, drill distance 6mil, keepout clearance 0mil
RestrictTop: area 41.2,14.4 to 50.4,20.9

### Footprints (pad centres in the part's own frame; a part is rotated, then mirrored left to right if it is on the bottom)
2450AT18B100E_ANTC3216X140N = smd 1.15 x 1.8: 1 -1.5,0; 2 1.5,0
NORDIC_NRF_3_RESC0201_L = smd 0.28 x 0.43: 1 -0.255,0; 2 0.255,0
PERFECT_0402_0402 = smd 0.6 x 0.7: 1 -0.5,0; 2 0.5,0
GRM011R60J152KE01L_1_0201 = smd 0.35 x 0.25: 1 0,0.275; 2 0,-0.275
GRM011R60J152KE01L_2_CAPC0201X13N = smd 0.22 x 0.23: 1 -0.185,0; 2 0.185,0
NORDIC_NRF_3_RESC0402_L = smd 0.5 x 0.6: 1 -0.5,0; 2 0.5,0
ESP32_C6_LIBRARY_5_SOD3716X135N = smd 1.15 x 0.8: 1 -1.75,0; 2 1.75,0
ESP32_C6_LIBRARY_3_SOT95P280X145-6N = smd 1.2 x 0.6: 1 -1.25,0.95; 2 -1.25,0; 3 -1.25,-0.95; 4 1.25,-0.95; 5 1.25,0; 6 1.25,0.95
BQ25180YBGR_BGA8C40P2X4_100X155X50 = smd 0.2 x 0.2: A1 -0.2,0.6; A2 0.2,0.6; B1 -0.2,0.2; B2 0.2,0.2; C1 -0.2,-0.2; C2 0.2,-0.2; D1 -0.2,-0.6; D2 0.2,-0.6
DRV2605YZFR_BGA9C50P3X3_144X144X62 = smd 0.25 x 0.25: A1 -0.5,0.5; A2 0,0.5; A3 0.5,0.5; B1 -0.5,0; B2 0,0; B3 0.5,0; C1 -0.5,-0.5; C2 0,-0.5; C3 0.5,-0.5
BMA423_BMA423 = smd 0.3 x 0.35: 1 -0.75,-0.775; 2 -0.25,-0.775; 3 0.25,-0.775; 4 0.75,-0.775; 7 0.75,0.775; 8 0.25,0.775; 9 -0.25,0.775; 10 -0.75,0.775 | smd 0.35 x 0.3: 5 0.775,-0.25; 6 0.775,0.25; 11 -0.775,0.25; 12 -0.775,-0.25
RT6160AWSC_BGA15C40P3X5_140X230X60 = smd 0.216 x 0.216: A1 -0.4,0.8; A2 0,0.8; A3 0.4,0.8; B1 -0.4,0.4; B2 0,0.4; B3 0.4,0.4; C1 -0.4,0; C2 0,0; C3 0.4,0; D1 -0.4,-0.4; D2 0,-0.4; D3 0.4,-0.4; E1 -0.4,-0.8; E2 0,-0.8; E3 0.4,-0.8
503480-2400_5034802400 = smd 0.3 x 0.7: 1 -5.75,1.525; 2 -5.25,1.525; 3 -4.75,1.525; 4 -4.25,1.525; 5 -3.75,1.525; 6 -3.25,1.525; 7 -2.75,1.525; 8 -2.25,1.525; 9 -1.75,1.525; 10 -1.25,1.525; 11 -0.75,1.525; 12 -0.25,1.525; 13 0.25,1.525; 14 0.75,1.525; 15 1.25,1.525; 16 1.75,1.525; 17 2.25,1.525; 18 2.75,1.525; 19 3.25,1.525; 20 3.75,1.525; 21 4.25,1.525; 22 4.75,1.525; 23 5.25,1.525; 24 5.75,1.525 | smd 0.3 x 1: MP1 -6.54,-1.125; MP2 6.54,-1.125
TC2030-IDC_TC2030IDC = smd 0.783 x 0.783: 1 -0.953,-0.635; 2 -0.953,0.635; 3 0.317,-0.635; 4 0.317,0.635; 5 1.588,-0.635; 6 1.588,0.635 | hole 2.451: -2.223,-2.54; -2.223,2.54; 0.952,-2.54; 0.952,2.54 | hole 1.067: -2.223,0; 2.857,-1.016; 2.857,1.016
KH-TYPE-C-16P_KINGHELM_KH-TYPE-C-16P = smd 0.6 x 1.15: A1_B12 -3.2,4.725; A4_B9 -2.4,4.725; A9_B4 2.4,4.725; A12_B1 3.2,4.725 | smd 0.3 x 1.15: A5 -1.25,4.725; A6 -0.25,4.725; A7 0.25,4.725; A8 1.25,4.725; B5 1.75,4.725; B6 0.75,4.725; B7 -0.75,4.725; B8 -1.75,4.725 | drill 0.65 pad 1.05: SH1 -4.32,0; SH2 4.32,0; SH3 -4.32,4.15; SH4 4.32,4.15 | hole 0.7: -2.89,3.65; 2.89,3.65
NORDIC_NRF_2_RESC0402_L = smd 0.5 x 0.6: 1 -0.5,0; 2 0.5,0
ESP32_C6_LIBRARY_2_IND_4828-WE-TPC_WRE = smd 0.9 x 5.3: 1 -2.286,0; 2 2.286,0
MLP2016SR47MT0S1_INDC2016X100N = smd 1.2 x 2.2: 1 -1.028,0; 2 1.028,0
ESP32_C6_LIBRARY_4_ESP32_C6_LIBRARY_4_ESP32_C6_LIBRARY_4_ESP32_C6_LIBRARY_4_ESP32_WROVER_SPARKFUN-DISCRETESEMI_SOT23-3 = smd 0.8 x 0.9: 1 -0.95,-1; 2 0.95,-1; 3 0,1.1
ESP32_C6_LIBRARY_6_SOT65P210X110-3N = smd 1.05 x 0.5: 1 -1.05,0.65; 2 -1.05,-0.65; 3 1.05,0
ERA-1AEB3401C_0201 = smd 0.35 x 0.25: 1 0,0.275; 2 0,-0.275
CPF0201D7K68C1_0201 = smd 0.35 x 0.25: 1 0,0.275; 2 0,-0.275
ESP32_C6_LIBRARY_7_JUMPER_SJ = smd 1.168 x 1.6: 1 -0.762,0; 2 0.762,0
2025-10-22_07-23-44_LIBRARY_SW_EVP-AKE31A_PAN = smd 0.711 x 1.092: 1 -1.4,-0.972; 2 1.4,-0.972 | drill 0.559 pad 0.914 square: 3 -1.848,0.381; 4 1.848,0.381 | smd 1.397 x 1.092: 5 0,-1.124
HECTOR_WATCH_1_TP20R = smd 2 x 2: TP 0,0
NORDIC_NRF_4_AQFN50P700X700X85_HS-74N = smd 4.85 x 4.85: P$74 0,0 | drill 0.3 pad 0.6: P$75 -1.8,1.8; P$76 -0.6,1.8; P$77 0.6,1.8; P$78 1.8,1.8; P$79 -1.8,0.6; P$80 -0.6,0.6; P$81 0.6,0.6; P$82 1.8,0.6; P$83 -1.8,-0.6; P$84 -0.6,-0.6; P$85 0.6,-0.6; P$86 1.8,-0.6; P$87 -1.8,-1.8; P$88 -0.6,-1.8; P$89 0.6,-1.8; P$90 1.8,-1.8 | smd 0.2 x 0.2: P$A8 -1.25,3.25; P$A10 -0.75,3.25; P$A12 -0.25,3.25; P$A14 0.25,3.25; P$A16 0.75,3.25; P$A18 1.25,3.25; P$A20 1.75,3.25; P$A22 2.25,3.25; P$A23 2.75,3.25; P$AA24 3.25,-2.25; P$AB2 -2.75,-2.5; P$AC5 -2,-2.75; P$AC9 -1,-2.75; P$AC11 -0.5,-2.75; P$AC13 0,-2.75; P$AC15 0.5,-2.75; P$AC17 1,-2.75; P$AC19 1.5,-2.75; P$AC21 2,-2.75; P$AC24 3.25,-2.75; P$AD2 -2.75,-3.25; P$AD4 -2.25,-3.25; P$AD6 -1.75,-3.25; P$AD8 -1.25,-3.25; P$AD10 -0.75,-3.25; P$AD12 -0.25,-3.25; P$AD14 0.25,-3.25; P$AD16 0.75,-3.25; P$AD18 1.25,-3.25; P$AD20 1.75,-3.25; P$AD22 2.25,-3.25; P$AD23 2.75,-3.25; P$B1 -3.25,2.75; P$B3 -2.5,2.75; P$B5 -2,2.75; P$B7 -1.5,2.75; P$B9 -1,2.75; P$B11 -0.5,2.75; P$B13 0,2.75; P$B15 0.5,2.75; P$B17 1,2.75; P$B19 1.5,2.75; P$B24 3.25,2.75; P$C1 -3.25,2.25; P$D2 -2.75,2; P$D23 2.75,2; P$E24 3.25,1.75; P$F2 -2.75,1.5; P$F23 2.75,1.5; P$G1 -3.25,1.25; P$H2 -2.75,1; P$H23 2.75,1; P$J1 -3.25,0.75; P$J24 3.25,0.75; P$K2 -2.75,0.5; P$L1 -3.25,0.25; P$L24 3.25,0.25; P$M2 -2.75,0; P$N1 -3.25,-0.25; P$N24 3.25,-0.25; P$P2 -2.75,-0.5; P$P23 2.75,-0.5; P$R1 -3.25,-0.75; P$R24 3.25,-0.75; P$T2 -2.75,-1; P$T23 2.75,-1; P$U1 -3.25,-1.25; P$U24 3.25,-1.25; P$V23 2.75,-1.5; P$W1 -3.25,-1.75; P$W24 3.25,-1.75; P$Y2 -2.75,-2; P$Y23 2.75,-2
ESP32_C6_LIBRARY_SON50P200X200X80-9N = smd 0.76 x 0.27: 1 -0.985,0.75; 2 -0.985,0.25; 3 -0.985,-0.25; 4 -0.985,-0.75; 5 0.985,-0.75; 6 0.985,-0.25; 7 0.985,0.25; 8 0.985,0.75 | smd 0.9 x 1.3: 9 0,0
NORDIC_NRF_BT-XTAL_2016_N = smd 0.95 x 0.85: 1 -0.725,-0.575; 2 0.725,-0.575; 3 0.725,0.575; 4 -0.725,0.575
NORDIC_NRF_1_XTAL_3215_N = smd 1 x 1.8: 1 -1.25,0; 2 1.25,0

### Placement (x,y rotation side)
ANT1  43.62,17.81 0 top
C1  41.66,22.51 0 top
C1-EP-DR  15.57,20.49 0 top
C2  37.65,22.35 90 top
C2-EP-DR  20.62,13.13 180 top
C3  39.97,16.74 270 top
C4  40.69,16.82 270 top
C5  31.52,18.7 180 top
C6  31.01,14.74 180 top
C7  35.83,12.38 270 top
C8  38.34,12.39 270 top
C9  39.83,15.38 0 top
C10  34.95,21.44 0 top
C11  39.75,19.32 0 top
C12  37.58,21.2 90 top
C13  36.82,21.21 90 top
C14  31.69,20.99 90 top
C15  35.12,22.33 0 top
C16  33.8,21.42 0 top
C17  30.28,21.19 0 top
C18  30.04,16.21 0 top
C19  8.65,6.18 270 top
C20  30.28,13.66 180 top
C21  32.8,11.89 270 top
C22  40.66,18.95 90 top
C23  14.52,33.67 0 top
C24  11.65,32.11 90 top
C25  11.66,30 90 top
C27  15.89,25.86 90 top
C29  32.62,5.92 270 top
C30  10.59,5.82 270 top
C31  21.57,6.08 270 top
C32  39.07,8.62 0 top
C33  12.75,28.4 0 top
C34  40.08,5.33 180 top
C37  23.05,25.02 0 top
C38  23.07,26.87 180 top
C39  23.07,25.94 0 top
C42  25.87,27.67 0 top
C43  27.88,27.53 0 top
D2  17.44,11.14 180 top
D3  26.06,25.5 0 top
D4  23.07,11.27 180 top
D5  16.99,13.17 0 top
EPD_C1  13.08,21.15 180 top
EPD_C2  13.08,22.2 180 top
EPD_C5  13.08,20.08 0 top
EPD_C6  13.08,18.95 180 top
EPD_C7  13.1,17.89 180 top
EPD_C8  13.17,16.37 180 top
EPD_C9  13.19,15.3 0 top
EPD_C10  13.17,14.23 180 top
EPD_C11  13.17,13.15 180 top
EPD_C12  13.17,12.08 180 top
IC1  20.85,25.83 0 top
IC2  39.3,6.97 0 top
IC3  8.09,7.88 0 top
IC9  13.84,31.56 0 top
J1  9.1,17.5 270 top
J2  34.32,28.02 0 top
J4  23,33.7 180 top
L1  40.13,17.85 0 top
L2  32.7,21.03 90 top
L3  33.16,22.43 0 top
L5  17.42,17.16 180 top
L7  16.61,31.47 270 top
Q1  43.15,11.5 270 top
Q3  16.15,22.38 0 top
R1_EP_DR  17.56,20.32 270 top
R1_USB  24.14,27.74 270 top
R2  7.54,6.25 0 top
R2_EP_DR  17.51,23.81 270 top
R2_USB  21.5,27.81 90 top
R3  6.93,6.27 180 top
R4  6.67,7.98 180 top
R5  11.66,5.58 180 top
R7  31.48,5.71 180 top
R8  20.53,5.83 180 top
R9  21.7,24.36 270 top
R17  13.38,29.73 90 top
R18  14.54,29.69 90 top
R_PWR_EPD  40.35,13.36 0 top
R_TYPE_SEL  17.47,21.35 0 top
SJ1  19.71,21.8 180 top
SW_DN  34,3 180 top
SW_ENT  23,3 180 top
SW_UP  12,3 180 top
TP_3.3V  31.67,33.39 0 top
TP_3V3  12.2,26.73 0 top
TP_BAT_GND  13.96,24.68 0 top
TP_GND  43.43,29.27 0 top
TP_ON  42.24,5.41 0 top
TP_OP  42.14,8.12 0 top
TP_RESET  39.9,33.31 0 top
TP_SCL  44.16,23.93 0 top
TP_SDA  44.07,26.59 0 top
TP_SWDCLK  37.01,33.42 0 top
TP_SWDIO  34.28,33.36 0 top
TP_SWO  42.41,31.87 0 top
TP_VBAT  14.48,27.01 0 top
TP_VREG  13.11,33.59 0 top
U1  35.59,16.47 0 top
U3  18.01,25.9 0 top
X1  39.58,21.96 180 top
X2  29.42,18.76 270 top

### Tracks (layer width: path | path; a pad name or v marks a point on that pad's centre or on a via)
3V3  (via drill 0.15 pad 0.3)
  Top 0.15: C34.2 39.56,5.66
  Top 0.3: C14.1 31.69,19.87 32.15,19.41 | C6.1 31.53,14.72 U1.P$W1 32.59,14.47 U1.P$Y2 32.07,13.85 31.85,13.85 v31.61,13.61 | U1.P$AD14 C7.1 v36.5,12.64 | IC3.3 8.34,6.74 C19.1 9.49,6.44 10.15,7.09 11.16,7.09 | IC9.E3 15.08,30.76 v15.1,30.74 | R18.1 14.27,30.73 IC9.E3 | 12.01,26.91 TP_3V3.TP 12.25,26.78 C33.1 12.25,29.62 | J2.1 33.64,27.11 v33.64,26.57 | v20.57,6.68 20.53,6.64 R8.2 11.91,6.11 R5.2 11.66,6.59 11.16,7.09 | R7.2 v31.48,6.68 | IC3.10 7.42,8.73 7.42,8.94 7.7,9.23 8.71,9.23 8.84,9.1 IC3.7 8.94,8.55 9.88,8.55 10.39,9.06 10.82,9.06 11.16,8.72 11.16,7.09 | 39.56,5.66 39.56,6.14 39.4,6.3 39.4,6.37 IC2.C2 39.2,6.37 39.2,6.3 39,6.1 v39,5.6 | v39.01,12.64 v39,12.64 C8.1 U1.P$AD23 39.04,13.22 39.16,13.09 40.34,13.09 R_PWR_EPD.2 41.43,12.01 41.43,11.93 42.15,11.21 Q1.2 | IC9.E3 IC9.E2 13.82,30.74 13.82,30.6 13.11,29.88 R17.1 12.36,29.73 12.25,29.62 | v32.75,34.25 32.5,34.25 31.75,33.5 TP_3.3V.TP v29.81,33.34 | C12.1 38.17,20.36 | 38.17,20.36 38.25,20.27 v38.25,20.25 | U1.P$A22 37.84,20.03 38.17,20.36 | v31.35,19.41 32.15,19.41 | 32.15,19.41 U1.P$B1 | 12.25,29.62 12.13,29.5 C25.1
  Route63 0.3: v29.81,33.34 28.17,33.34 27.68,32.84 15.4,32.84 15.24,33 14.78,33 14.46,32.67 14.46,32.21 15.1,31.57 v15.1,30.74 | 33.67,24.83 33.67,26.13 33.64,26.16 v33.64,26.57 | v31.61,13.61 31.37,13.37 31.37,11.41 32.34,10.44 32.34,7.54 v31.48,6.68 v20.57,6.68 21.5,5.75 38.85,5.75 v39,5.6 39.86,6.46 39.86,7.19 39.5,7.54 39.5,10.67 39.01,11.16 v39.01,12.64 37.73,12.64 | v36.5,12.64 37.73,12.64 | 37.73,12.64 | 37.73,12.64 37.73,14.02 40.38,16.67 40.38,18.84 40,19.21 40,20.91 39.2,21.72 36.75,21.72 | 36.75,21.72 33.67,24.8 33.67,24.83 | 36.75,21.72 39.19,24.16 43.36,24.16 44.85,25.65 44.85,28.42 38.97,34.3 32.8,34.3 v32.75,34.25 | 33.67,24.83 32.56,23.71 32.05,23.71 31.35,23.02 31.35,22.06 | 31.35,22.06 v31.35,19.41 31.47,19.29 | v38.25,20.25 35.58,20.25 35.48,20.35 35.48,21.78 35.2,22.06 31.35,22.06
ALERT  (via drill 0.15 pad 0.3)
  Top 0.15: U1.P$J24 38.98,17.22 v39.34,16.86 | v18.99,24.04 U3.5
  Route63 0.15: v39.34,16.86 39.34,18.16 38.5,19 37.65,19 37.65,19.6 37.36,19.89 35.27,19.89 35.27,19.88 34.38,18.99 33.01,18.99 32.68,18.65 28.98,18.65 28.85,18.78 27.7,18.78 27.32,19.16 27.32,19.21 23.22,23.31 19.28,23.31 18.99,23.6 v18.99,24.04
D+  (via drill 0.15 pad 0.3)
  Top 0.15: v28.5,24 28,24.5 27.5,24.5 D3.4 | v34.25,12.64 34.25,12.75 33.84,13.16 U1.P$AD6
  Bottom 0.15: v34.25,12.64 33.54,12.64 31.85,14.33 31.31,14.33 29.71,15.93 30.13,16.35 30.96,16.35 31.39,16.78 31.39,17.08 31.19,17.28 30.86,17.28 30.27,17.87 30.27,20.87 28.5,22.64 v28.5,24
D-  (via drill 0.15 pad 0.3)
  Top 0.15: U1.P$AD4 33.25,13.25 33.25,13 33.75,12.5 33.75,11.12 32.97,10.34 v31.57,10.34 | D3.6 27.5,26.5 28,26.5 29,25.5 29,23.75 27.52,22.27 27.52,19.69 v26.84,19.01
  Bottom 0.15: v31.57,10.34 31.57,10.68 28.33,13.92 28.33,17.69 27.01,19.01 v26.84,19.01
DEC1
  Top 0.15: C5.1 31.8,18.72 U1.P$C1
DEC3
  Top 0.15: U1.P$D23 38.79,18.92 38.96,18.92 39.36,19.32 C11.1
DEC4_6  (via drill 0.15 pad 0.3)
  Top 0.15: C10.1 34.67,21.47 34.67,22.22 C15.1 34.42,22.47 33.67,22.47 L3.2 33.67,22.22 33.67,21.47 C16.1 33.42,21.22 33.5,20.18 33.5,19.71 33.51,19.71 | 33.5,19.25 U1.P$B5 33.51,19.3 33.51,19.71 | U1.P$E24 38.97,18.22 39.36,18.61 v39.59,18.61 | 33.51,19.71 v33.51,19.94
  Bottom 0.15: v33.51,19.94 33.73,19.71 38.26,19.71 39.36,18.61 v39.59,18.61
DN  (via drill 0.15 pad 0.3)
  Top 0.15: J4.A7 22.75,28.25 23,28 23.25,28 | 23.25,28 23.5,28 23.75,28.25 J4.B7 | 23.25,28 v23.25,27.75 | D3.1 24.75,26.5 24.75,26.99 v24.94,27.18
  Bottom 0.15: v23.25,27.75 24.25,27.75 24.82,27.18 v24.94,27.18
DP  (via drill 0.15 pad 0.3)
  Top 0.127: 23,29.75 22.5,29.75
  Top 0.15: 22.5,29.75 22.25,29.5 J4.B6 22.25,27.9 v22.4,27.75 | 23,29.75 23.25,29.5 J4.A6 | v26,24.55 | v26,24.55 D3.3
  Bottom 0.15: v22.4,27.75 22.9,27.25 23.25,27.25 25.95,24.55 v26,24.55
EPD_3V3  (via drill 0.15 pad 0.3)
  Top 0.3: EPD_C5.2 13.99,20.49 C1-EP-DR.1 15.07,17.22 L5.2 15.35,17.38 v16.19,17.38 | Q1.3 44.15,11.4 v43.16,11.4 | v9.74,15.95 10.32,15.95 J1.15 J1.16
  Route63 0.3: v43.16,11.4 43.16,8.48 39.2,4.52 19.17,4.52 19.17,13.39 19.68,13.89 v16.19,17.38 11.18,17.38 10.04,16.24 10.03,16.24 v9.74,15.95
  Bottom 0.3: 16.18,17.37 v16.19,17.38
EPD_BUSY  (via drill 0.15 pad 0.3)
  Top 0.15: v34.73,9.78 35.25,10.3 35.25,13.25 U1.P$AD12 | v9.75,19 9.98,19 10.23,19.25 J1.9
  Bottom 0.15: v34.73,9.78 34.73,6.25 21.5,6.25 20.5,7.25 10,7.25 9.75,7 9.25,7 9.04,7.21 9.04,18.72 9.32,19 v9.75,19
EPD_CS  (via drill 0.15 pad 0.3)
  Top 0.15: U1.P$K2 v32.83,17.07 | v11.62,18.98 11.27,18.63 11.27,17.89 11.13,17.75 J1.12 | v25.29,19.78 24.42,19.78 v24.07,19.43
  Route63 0.15: 25.49,19.35 25.49,19.37 | 25.49,19.35 25.29,19.55 v25.29,19.78 | v32.83,17.07 31.53,18.37 28.88,18.37 28.73,18.51 26.33,18.51 25.49,19.35
  Bottom 0.15: v24.07,19.43 23.62,18.98 v11.62,18.98
EPD_DC  (via drill 0.15 pad 0.3)
  Top 0.15: v9.75,18.09 9.91,18.25 J1.11 | U1.P$AD10 34.75,13.25 34.75,11.64 v31.61,8.5
  Bottom 0.15: v31.61,8.5 31.61,8.64 27.5,12.75 27.5,18.02 27.06,18.46 26.7,18.46 26.53,18.29 11.5,18.29 11.3,18.09 v9.75,18.09
EPD_RST  (via drill 0.15 pad 0.3)
  Top 0.15: U1.P$AC11 35.03,13.66 v34.98,13.66 | v9.23,19.81 9.23,18.81 9.51,18.53 9.9,18.53 10.12,18.75 J1.10
  Route63 0.15: v34.98,13.66 34.56,13.66 32.77,11.87 32.17,11.87 31.98,11.68 v31.98,11.59 | v30.61,12.33 27.99,14.95 26.79,14.95 22.58,19.16 22.58,20.85 9.63,20.85 9.2,20.42 9.2,19.84 v9.23,19.81
  Bottom 0.15: v31.98,11.59 31.36,11.59 v30.62,12.33 v30.61,12.33
GDR  (via drill 0.15 pad 0.3)
  Top 0.15: R2_EP_DR.2 16.89,23.03 Q3.1 v14.13,23.03 | J1.2 10.65,22.78 12.13,22.78 v12.38,23.03
  Bottom 0.15: v14.13,23.03 v12.38,23.03
GND  (via drill 0.15 pad 0.3)
  Top 0.15: C38.1 C39.2 | C39.2 C37.2 | EPD_C11.1 EPD_C10.1 | EPD_C10.1 13.64,14.26 | 13.64,16.34 EPD_C8.1 EPD_C9.1 13.67,14.32 EPD_C10.1 | C38.1 24.07,27.36 24.41,27.7 R1_USB.1 | R2_USB.2 22.21,27.37 22.91,27.37 23.41,26.87 C38.1 | C39.2 24.37,25.94 D3.2 | R9.1 21.75,24.58 21.75,24.62 21.63,24.74 21.56,24.74 21.07,25.23 IC1.D2 | J2.3 J2.5 36.46,27.94 v36.49,27.94 | U3.6 18.26,25.65 U3.9 | U1.P$B7 34.09,18.57 | 34.09,18.57 U1.P$75 | C13.2 37.57,21.46 C12.2 | IC9.C1 IC9.C2 IC9.C3 | U1.P$F23 37.69,17.97 U1.P$78 | U1.P$74 34.09,17.97 34.09,18.57 | C11.2 40.55,19.32 C22.2 | C3.2 40.05,16.57
  other vias: 14.44,4.25 7.9,7.77 33.84,20.73 38,6.9 24.6,33.6 22.8,33.6 21,33.6 17.4,33.6 15.6,33.6 10.2,33.6 8.4,33.6 6.6,33.6 4.8,33.6 30,31.8 28.2,31.8 26.4,31.8 24.6,31.8 22.8,31.8 21,31.8 19.2,31.8 10.2,31.8 8.4,31.8 6.6,31.8 4.8,31.8 3,31.8 40.8,30 39,30 30,30 28.2,30 24.6,30 21,30 10.2,30 8.4,30 6.6,30 4.8,30 3,30 1.2,30 42.6,28.2 40.8,28.2 39,28.2 28.2,28.2 10.2,28.2 8.4,28.2 6.6,28.2 4.8,28.2 3,28.2 1.2,28.2 42.6,26.4 40.8,26.4 39,26.4 8.4,26.4 6.6,26.4 4.8,26.4 3,26.4 1.2,26.4 42.6,22.8 26.4,22.8 24.6,22.8 22.8,22.8 24.6,21 22.8,17.4 21,17.4 22.8,15.6 21,15.6 26.4,13.8 21,13.8 17.4,13.8 26.4,12 24.6,12 17.4,12 15.6,12 44.4,10.2 37.2,10.2 28.2,10.2 26.4,10.2 24.6,10.2 22.8,10.2 17.4,10.2 15.6,10.2 13.8,10.2 12,10.2 10.2,10.2 44.4,8.4 40.8,8.4 35.4,8.4 33.6,8.4 30,8.4 28.2,8.4 26.4,8.4 24.6,8.4 22.8,8.4 21,8.4 4.8,8.4 3,8.4 1.2,8.4 44.4,6.6 35.4,6.6 17.4,6.6 15.6,6.6 13.8,6.6 28.2,1.2 26.4,1.2 19.2,1.2 17.4,1.2 15.6,1.2 8.4,1.2 6.6,1.2 4.8,1.2 30,1.2 37.2,1.2 39,1.2 40.8,1.2 3,3 4.8,3 6.6,3 8.4,3 12,3 15.6,3 17.4,3 19.2,3 22.8,3 26.4,3 28.2,3 30,3 37.2,3 39,3 40.8,3 42.6,3 1.2,4.8 3,4.8 4.8,4.8 6.6,4.8 10.2,4.8 13.8,4.8 15.6,4.8 17.4,4.8 40.8,4.8 44.4,4.8 1.2,6.6 3,6.6 4.8,6.6
  pour Route2: -2.44,39.92 46.48,39.92 46.67,40.11 46.67,20.97 41.04,20.97 41.04,13.67 46.6,13.67 46.6,-2.27 46.57,-2.3 -1.99,-2.3 -2.05,-2.36 -2.05,39.53
  pour Top: 40.88,19.38 40.8,19.46 40.89,19.37
  pour Top: -2.97,38.33 -2.7,38.06 45.94,38.06 46.63,37.37 46.63,20.94 41.22,20.94 41.22,14.42 46.98,14.42 46.98,-1.43 44.69,-3.72 -2.54,-3.72 -2.72,-3.54 -2.72,38.08
  pour Bottom: -9.9,40.44 52.11,40.44 52.11,22.75 50.24,20.88 41.15,20.88 41.15,14.24 49.52,14.24 49.52,-6.83 49.36,-6.99 -9.54,-6.99 -11.58,-4.95 -11.58,38.76
HAPTIC_EN  (via drill 0.15 pad 0.3)
  Top 0.15: U1.P$U1 32.09,15.46 29.81,15.46 v29.46,15.12 | v38.05,7.62 38.66,7.62 IC2.A1
  Bottom 0.15: v29.46,15.12 29.46,14.56 31.83,12.19 32.82,12.19 37.39,7.62 v38.05,7.62
IMU_INT1  (via drill 0.15 pad 0.3)
  Top 0.15: v9.5,7.5 9,7.5 IC3.5 | U1.P$N1 32.25,16.25 30.85,16.25 30.84,16.26 30.72,16.14 30.72,15.76 27.49,15.76 v27,16.25
  Bottom 0.15: v27,16.25 18.5,7.75 9.75,7.75 v9.5,7.5
IMU_INT2  (via drill 0.15 pad 0.3)
  Top 0.15: v32.5,15.77 32.7,15.97 U1.P$P2 | v10.66,8.48 10.31,8.13 IC3.6
  Route63 0.15: v32.5,15.77 31.08,15.77 28.62,18.23 27.16,18.23 v26.93,18
  Bottom 0.15: v26.93,18 17.41,8.48 v10.66,8.48
LX1
  Top 0.15: IC9.B2 13.75,32 14.25,32 IC9.B3 15.21,31.96 15.75,32.5 16.5,32.5 L7.1
LX2
  Top 0.15: L7.2 15.9,31.16 IC9.D3 IC9.D2
MOSI  (via drill 0.15 pad 0.3)
  Top 0.15: U1.P$B13 35.59,19.29 v35.6,19.3 | v9.43,16.61 10.48,16.61 J1.14
  Route63 0.15: v25.77,21.49 v25.78,21.49 27.39,19.88 27.39,19.53 27.6,19.32 27.6,19.27 27.81,19.06 28.96,19.06 29.09,18.93 31.6,18.93 v32.5,19.83 | v21.66,19.86 19.66,17.86 15.99,17.86 15.94,17.81 10.76,17.81 10.23,17.28 10.23,17.05 9.95,16.77 9.59,16.77 v9.43,16.61
  Bottom 0.15: v35.6,19.3 33.32,19.3 32.79,19.83 v32.5,19.83 | v25.77,21.49 24.13,19.85 v21.67,19.85 v21.66,19.86
N$1
  Top 0.15: C4.1 40.5,16.93 40.5,17.49 L1.2 | C22.1 40.5,18.82 40.5,18 40.67,18 L1.2 | L1.2 40.69,17.79 42.1,17.79 ANT1.1
N$2  (via drill 0.15 pad 0.3)
  Top 0.15: IC9.D1 12.7,31.16 v12.49,31.37 | v6.7,9.04 6.7,8.29 R4.2
  Bottom 0.15: v12.49,31.37 11.98,30.86 11.98,28.31 7.57,23.9 7.57,9.26 7.3,8.99 6.75,8.99 v6.7,9.04
N$3
  Top 0.15: R9.2 21.43,24.48 20.98,24.93 20.93,24.93 20.75,25.11 20.75,25.13 IC1.D1
N$4
  Top 0.15: U1.P$A23 38.25,19.75 38.5,19.75 38.75,20 38.75,21.29 X1.3 38.76,21.5 38.15,21.5 C2.1
N$5  (via drill 0.15 pad 0.3)
  Top 0.15: IC9.E1 13.36,30.68 v12.5,30.68 | v7.68,5.37 7.54,5.51 R2.2
  Bottom 0.15: v12.5,30.68 12.6,30.58 12.6,28.42 7.92,23.74 7.92,8.78 7.78,8.64 5.52,8.64 5.2,8.32 5.2,6.32 6.17,5.35 7.66,5.35 v7.68,5.37
N$6
  Top 0.15: J4.A5 24.25,28.25 23.75,27.75 R1_USB.2
N$7
  Top 0.15: L3.1 32.67,22.22 32.67,21.62 L2.2
N$8
  Top 0.15: IC3.1 7.25,7 7.25,6.87 R3.2
N$9  (via drill 0.15 pad 0.3)
  Top 0.15: v39.75,23.5 40,23.25 40,22.75 40.22,22.53 X1.1 | v41.5,21.75 41.5,22.5 C1.1 | U1.P$B24 39.15,19.54 39.15,19.62 39.27,19.74 40.1,19.74 v40.71,20.35
  Bottom 0.15: 40.83,21.75 v41.5,21.75 | v39.75,23.5 39.75,22.83 40.83,21.75 | 40.83,21.75 40.83,20.46 v40.71,20.35
N$10
  Top 0.15: U1.P$H23 38.25,17.5 38.5,17.5 38.75,17.75 39.44,17.75 L1.1 39.63,17.34 C3.1
N$11
  Top 0.15: C32.2 39.57,7.74 IC2.A2
N$13
  Top 0.15: C2-EP-DR.1 21.13,13.03 21.13,11.18 D4.2
  Top 0.152: D2.1 19.23,11.18 21.13,11.18
N$14
  Top 0.15: U1.P$N24 38.75,16.25 39,16.25 39.58,15.68 C9.1
N$15
  Top 0.15: 18.88,21.54 18.88,21.78 SJ1.2 | 18.88,21.54 18.88,21.53 | R_TYPE_SEL.2 17.84,20.71 | 17.84,20.71 R1_EP_DR.1 | 17.84,20.71 18.66,21.54 18.88,21.54
N$16  (via drill 0.15 pad 0.3)
  Top 0.15: 18.88,13.28 19.88,13.28 C2-EP-DR.2 | v17.38,23.03 17.38,22.53 Q3.3 | v18.76,20.24 19.63,19.37 19.63,17.28 L5.1 19.63,17.03 19.63,16.78 18.88,16.03 18.88,13.28 | 18.88,13.28 D5.2
  Bottom 0.15: v17.38,23.03 17.38,20.24 v18.76,20.24
N$17
  Top 0.15: J1.4 10.65,21.78 12.13,21.78 12.38,22.03 EPD_C2.2
N$18
  Top 0.15: J1.5 10.65,21.28 12.38,21.28 EPD_C1.2
N$20
  Top 0.15: C20.1 31.34,13.1 31.62,13.1 31.89,13.37 32.49,13.37 32.69,13.57 33.44,13.57 U1.P$AC5
N$22
  Top 0.15: U1.P$B3 33,19.25 32.92,19.33 32.92,20.31 L2.1
N$26
  Top 0.15: J4.B5 21.25,27.75 R2_USB.1
N$30
  Top 0.15: EPD_C6.2 11.62,17.99 11.62,16.4 11.35,16.13 11.35,14.97 11.13,14.75 J1.18
N$31
  Top 0.15: EPD_C7.2 11.98,17.27 11.98,16.29 11.74,16.05 11.74,14.37 11.55,14.18 10.7,14.18 J1.19
N$32
  Top 0.15: J1.20 10.73,13.64 11.65,13.64 12.02,14.01 12.02,15.71 EPD_C8.2
N$34
  Top 0.15: J1.22 10.65,12.78 11.88,12.78 12.13,13.03 12.13,13.69 EPD_C10.2
N$35
  Top 0.15: U1.P$A18 36.75,19.75 36.75,20.94 C13.1
N$37
  Top 0.15: J1.24 10.65,11.78 11.88,11.78 12.13,12.03 12.63,12.03 EPD_C12.2
OUT+
  Top 0.15: TP_OP.TP 41.49,7.47 IC2.A3
OUT-
  Top 0.15: IC2.C3 41.19,6.47 TP_ON.TP
P0.00/XL1
  Top 0.15: C17.2 30.5,21.2 30.5,20.98 X2.1 29.65,20.01 29.65,19.27 31.07,17.85 31.65,17.85 32.1,18.3 32.67,18.3 U1.P$D2
P0.01/XL2
  Top 0.15: X2.2 29.06,17.51 | U1.P$F2 32.79,18.02 32.21,18.02 32.01,17.82 32.01,17.79 31.73,17.51 X2.2 | X2.2 29.42,17.33 30.3,16.45 C18.2
P0.13
  Top 0.15: 10.75,5.25 11.5,5.25 R5.1 | 10.75,5.25 10.75,4 SW_UP.2 | 10.75,5.25 C30.2
P0.14
  Top 0.15: 21.5,5.5 20.5,5.5 R8.1 | 21.5,5.5 21.5,4 SW_ENT.2 | 21.5,5.5 C31.2
P1.01  (via drill 0.15 pad 0.3)
  Top 0.15: Q1.1 41.5,13.1 41.5,13.27 v41.37,13.4 | v41.06,13.91 40.35,13.91 R_PWR_EPD.1 | U1.P$Y23 38.29,14.42 v38.29,13.72
  Bottom 0.15: v38.29,13.72 38.29,13.79 39.59,15.09 39.97,15.09 41.06,14 v41.06,13.91 41.37,13.6 v41.37,13.4
P1.02  (via drill 0.15 pad 0.3)
  Top 0.15: R7.1 31.5,5.5 32.25,5.5 32.5,5.75 32.75,5.75 32.75,5.5 C29.2 32.75,5.25 32.75,4 SW_DN.2 32.75,3.75 v33.5,3 | v39.82,14.74 38.78,14.74 U1.P$W24
  Bottom 0.127: 39.75,7.01 39.75,4.03 39.22,3.5
  Bottom 0.15: v39.82,14.74 39.82,7.08 39.75,7.01 | 39.22,3.5 34,3.5 v33.5,3
PMIC_INT  (via drill 0.15 pad 0.3)
  Top 0.15: U1.P$T2 32.84,15.03 v32.77,14.96 | v19.31,27.47 19.61,27.47 IC1.A1
  Route63 0.15: v19.31,27.47 19.28,27.44 19.01,27.44 18.71,27.74 15.6,27.74 15.33,27.47 15.33,25.79 15.38,25.79 16.09,25.08 16.09,25.05 18.21,22.93 21.27,22.93 26.7,17.5 28.59,17.5 31.13,14.96 v32.77,14.96
PREVGH  (via drill 0.15 pad 0.3)
  Top 0.15: v9.75,13.25 J1.21 | D5.1 15.13,13.03 14.88,13.28 14.88,13.78 v14.63,14.03 14.37,14.29 14.37,15.05 14.12,15.3 EPD_C9.2
  Bottom 0.15: v9.75,13.25 10.53,14.03 v14.63,14.03
PREVGL  (via drill 0.15 pad 0.3)
  Top 0.15: EPD_C11.2 12.63,13.03 12.63,12.78 12.38,12.78 11.88,12.28 10.65,12.28 J1.23 10,12.25 v9.75,12 | D2.2 15.45,11.03 v14.38,11.03
  Bottom 0.15: v14.38,11.03 13.41,12 v9.75,12
RESE  (via drill 0.15 pad 0.3)
  Top 0.15: 15.38,21.78 15.13,21.78 Q3.2 15.38,21.78 | 15.38,21.78 16.72,21.78 R1_EP_DR.2 | v9.75,22.25 J1.3 | v15.88,22.28 15.63,22.03 15.38,22.03 15.38,21.78
  Bottom 0.15: v15.88,22.28 9.78,22.28 v9.75,22.25
RESET  (via drill 0.15 pad 0.3)
  Top 0.15: 37.21,30.25 39.75,32.79 39.75,33.25 TP_RESET.TP | 37.21,30.25 36.25,29.29 36.25,29 36,28.75 J2.6 | v35.67,13.72 U1.P$AC13 | v36.98,30.53 37.21,30.3 37.21,30.25
  Bottom 0.15: v35.67,13.72 35.67,13.25 35.4,12.98 34.9,12.98 34.56,13.32 34.03,13.32 33.96,13.25 33.8,13.25 31.98,15.07 31.98,17.27 31.42,17.84 31.31,17.84 30.82,18.32 30.82,21.39 30.49,21.72 30.2,21.72 29.9,22.02 29.9,22.4 30.1,22.6 30.4,22.6 30.47,22.53 32.3,22.53 32.66,22.89 32.66,23.33 32.48,23.51 32.13,23.51 32.03,23.41 30.36,23.41 30.3,23.36 29.59,24.07 29.59,27.32 30.41,28.15 30.41,32.03 31.49,33.11 36.15,33.11 37.05,32.21 37.05,30.6 v36.98,30.53
SCK  (via drill 0.15 pad 0.3)
  Top 0.15: v34.67,20.72 35.17,20.22 35.09,19.97 U1.P$A12 | v30.25,22.25 29.8,22.25 v29.01,21.46 | J1.13 v9.75,17.25
  Bottom 0.15: v34.67,20.72 33.14,22.25 v30.25,22.25 | v9.75,17.25 9.4,17.6 9.4,18.24 9.73,18.57 25.9,18.57 27.35,20.02 27.57,20.02 v29.01,21.46
SCL  (via drill 0.15 pad 0.3)
  Top 0.15: v45.25,22.75 44.25,23.75 TP_SCL.TP 44,24 v43,25 | IC2.C1 38.75,6.5 37.5,6.5 37.5,8.75 38.75,10 38.92,10 | IC3.12 7.25,7.75 6.75,7.75 R4.1 6.5,7.75 v6,8.25 | 18.77,26.24 U3.7 19.41,26.15 19.64,25.92 | v20.87,24.5 20.08,24.5 19.64,24.94 19.64,25.92 | IC1.B1 19.75,26.03 19.64,25.92 | v40.23,10 38.92,10 | v38.95,10.44 38.95,10.03 38.92,10 | U1.P$M2 32.84,16.41 v32.81,16.38
  Top 0.152: v14.09,28.99 13.65,29.43 R17.2
  Bottom 0.15: 9.85,24.75 v14.09,28.99 14.85,29.75 15.5,29.75 17,28.25 24.5,28.25 25.75,27 28.59,27 29.4,27.81 29.4,32.11 30.7,33.41 38.3,33.41 41.84,29.87 41.84,26.16 v43,25 | v20.87,24.5 20.62,24.75 9.85,24.75 | 9.85,24.75 9.5,24.75 8.37,23.62 8.37,8.61 8.01,8.25 v6,8.25 | 40.88,16.17 40.94,16.17 | v40.23,10 40.23,10.23 42.05,12.05 42.05,13.89 40.88,15.06 40.88,16.17 | v38.95,10.44 38.95,11.22 36.44,13.73 36.17,13.73 35.83,14.07 35.44,14.07 35.43,14.06 33.54,14.06 33.18,14.42 33.18,16.3 33.1,16.38 v32.81,16.38 | v45.25,22.75 45.23,22.77 44.09,22.77 42.06,20.74 41.5,20.74 41.41,20.65 41.41,20.09 40.88,19.55 40.88,16.17
SDA  (via drill 0.15 pad 0.3)
  Top 0.15: IC2.B2 v39.3,6.96 | 7.75,7 IC3.2 7.7,6.96 7.7,6.84 7.54,6.69 R2.1 7.87,6.53 8.06,6.33 8.06,5.65 v8.66,5.05 | R18.2 14.75,29.75 v15.25,29.25 v16.75,29.25 | U3.8 19.02,26.74 18.63,27.13 v18.5,27.13 | v44.25,28 44.25,26.75 TP_SDA.TP | v35.75,23.5 32.62,23.5 v32.28,23.16 | IC1.C1 20.55,25.53 20.52,25.53 20.18,25.19 v20.02,25.19 | v30.9,16.91 31.09,16.72 U1.P$L1
  Bottom 0.15: 34,11.75 31.74,14.01 31.23,14.01 29.29,15.95 30.08,16.74 30.89,16.74 30.9,16.75 v30.9,16.91 | v15.25,29.25 17.25,27.25 18.39,27.25 v18.5,27.13 19.15,27.13 19.16,27.12 19.57,27.12 20.02,26.67 v20.02,25.19 21.08,25.19 21.92,24.35 21.92,22.53 18.83,19.44 9.08,19.44 8.74,19.1 8.74,5.13 v8.66,5.05 | v16.75,29.25 18.5,31 26.25,31 29,33.75 38.5,33.75 v44.25,28 44.25,25.5 43.25,24.5 36.75,24.5 v35.75,23.5 | 34,11.75 37.77,7.98 38.38,7.98 39.3,7.06 v39.3,6.96 | 34,11.75 34.6,12.35 34.6,12.79 34.4,12.99 34.1,12.99 34.07,12.96 33.64,12.96 31.67,14.93 31.67,17.19 31.3,17.56 30.97,17.56 30.54,17.99 30.54,20.98 29.34,22.18 29.34,22.46 29.76,22.88 32,22.88 v32.28,23.16
SWDCLK  (via drill 0.15 pad 0.3)
  Top 0.15: v35.25,28 34.75,28.5 J2.4 | v35.75,32.75 36.25,33.25 37,33.25 TP_SWDCLK.TP | U1.P$AA24 v39.35,14.22 v39.36,14.21
  Bottom 0.127: v35.25,28 35.25,27.58 33.78,26.11 33.78,24.86 35.55,23.1 37.67,23.1 40.21,20.57 40.21,16.23 37.95,13.97 37.95,13.58 38.15,13.38 38.53,13.38 v39.36,14.21
  Bottom 0.15: v35.25,28 33.76,29.49 33.76,31.17 35.34,32.75 v35.75,32.75
SWDIO  (via drill 0.15 pad 0.3)
  Top 0.15: TP_SWDIO.TP 34.25,33.25 34.25,32.75 33.75,32.25 33.75,29.75 34,29.5 34,29.25 33.5,28.75 J2.2 33.41,28.7 v33.41,29.46 | U1.P$AC24 39.14,13.72 v39.34,13.52
  Bottom 0.15: v39.34,13.52 38.86,13.04 38.12,13.04 37.68,13.47 37.68,14.08 39.95,16.34 39.95,20.45 37.65,22.75 35.46,22.75 34.23,23.98 30.68,23.98 29.98,24.68 29.98,27.04 31.94,29.01 32.71,29.01 33.16,29.46 v33.41,29.46
SWO  (via drill 0.15 pad 0.3)
  Top 0.15: v43.5,30.75 42.5,31.75 TP_SWO.TP | U1.P$AD22 37.75,13.25 37.75,12.75 37.5,12.5 37.5,11.75 37.75,11.5 v40.23,11.5
  Bottom 0.15: v43.5,30.75 44.25,30 45.25,30 45.25,24.32 41.97,21.04 41.4,21.04 41.12,20.76 41.12,20.19 40.6,19.67 40.6,14.91 41.72,13.79 41.72,12.99 v40.23,11.5
VBAT  (via drill 0.15 pad 0.3)
  Top 0.15: 16,26.15 C27.2 15.66,26.05
  Top 0.3: 16,26.15 16.27,26.15 | 16.27,26.15 U3.2 U3.3 | IC1.C2 21.07,25.61 21.21,25.61 21.66,25.16 | v21.75,25.25 21.66,25.16 | 16.27,26.15 16.27,26.46 v16.24,26.49 | C37.1 21.85,25.02 21.78,25.09 21.72,25.09 21.66,25.16 | 15.66,26.05 14.7,27.01 TP_VBAT.TP
  Route63 0.3: v21.75,25.25 21.57,25.07 20.63,25.07 20.63,25.47 19.61,26.49 v16.24,26.49
VBUS  (via drill 0.15 pad 0.3)
  Top 0.15: 26.09,27.71 C42.2 26,27.73 26,27.87 25.88,27.99 25.52,27.99 25.4,28.11
  Top 0.3: D3.5 v26.25,25.5 26.11,25.5 26.09,25.52 26.09,26.65 26.97,27.53 C43.1 27.2,27.71 26.09,27.71 | U1.P$AD2 32.8,13.18 C21.1 32.74,12.39 v32.12,13.02 | C38.2 21.49,26.87 IC1.A2 21.03,26.45 21.03,26.59 20.6,27.01 20.6,27.29 | 25.4,28.11 J4.A4_B9 | J4.A9_B4 20.6,27.29 | v27.9,19.72 v27.91,19.71 v27.91,16.91 | 20.6,27.29 v20.52,27.28
  Route63 0.3: v27.9,19.72 27.9,22.61 26.95,23.56 | 26.95,23.56 26.95,25.45 26.9,25.5 v26.25,25.5 | 26.95,23.56 26.19,23.56 25.83,23.92 25.66,23.92 22.58,27 20.8,27 v20.52,27.28 | v27.91,16.91 28.67,16.91 31.41,14.17 31.84,14.17 32.16,13.84 32.16,13.32 32.12,13.28 v32.12,13.02
VREG  (via drill 0.15 pad 0.3)
  Top 0.15: 21.51,26.03 IC1.B2
  Top 0.3: 21.91,25.94 21.6,25.94 21.51,26.03 | 21.91,25.94 C39.1 | IC9.A1 13.48,32.36 | IC9.A1 IC9.A2 IC9.A3 14.93,32.36 v15.01,32.44 | v21.89,26.4 21.91,26.38 21.91,25.94 | C24.2 12.63,33.59 TP_VREG.TP | C23.2 13.31,33.39 TP_VREG.TP | IC9.A1 12.93,32.87 12.93,33.41 TP_VREG.TP
  Route63 0.3: v21.89,26.4 21.86,26.43 20.48,26.43 19.89,27.02 19.89,27.48 20.04,27.63 20.04,27.95 19.87,28.12 18.9,28.12 17.82,29.2 17.82,29.63 v15.01,32.44